# EAGLE design Power Stage (EAGLE 5.11)

## Sheet 1 of 7
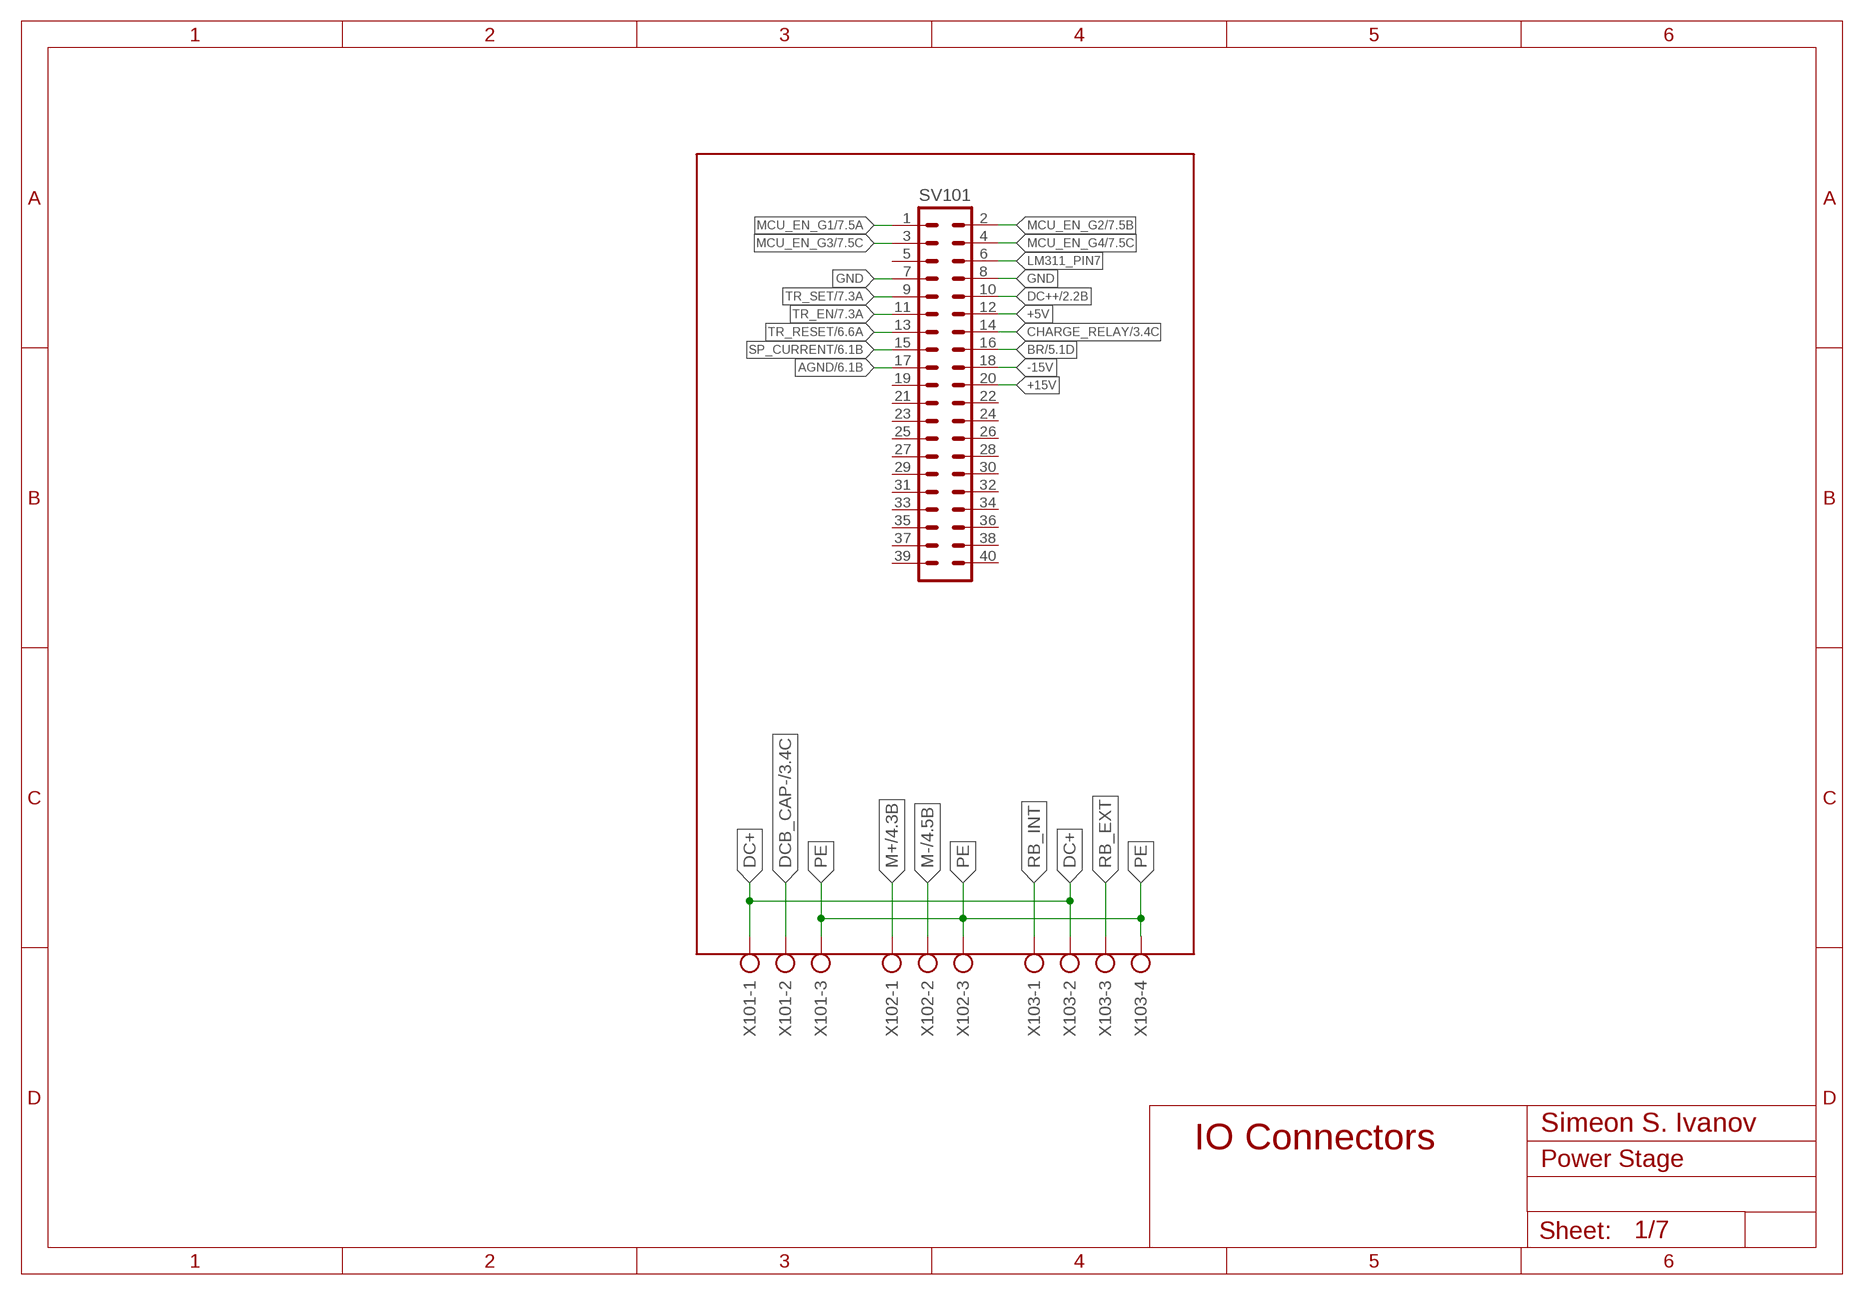
[diagram p0: schematic, sheet 1]

### Parts
SV101  ML40  [ML40]
X101  AK500/3-H  [AK500/3-H]
X102  AK500/3-H  [AK500/3-H]
X103  AK500/4-H  [AK500/4-H]

### Nets
+5V: SV101.12 ; also sheet 2,6,7
+15V: SV101.20 ; also sheet 2,6
-15V: SV101.18 ; also sheet 2,6
AGND: SV101.17 ; also sheet 2,4,6
BR: SV101.16 ; also sheet 5
CHARGE_RELAY: SV101.14 ; also sheet 3
DC+: X101.1 X103.2
DC++: SV101.10 ; also sheet 2,3
DCB_CAP-: X101.2 ; also sheet 3,4
GND: SV101.7 SV101.8 ; also sheet 2,4,5,6,7
LM311_PIN7: SV101.6
M+: X102.1 ; also sheet 4
M-: X102.2 ; also sheet 4
MCU_EN_G1: SV101.1 ; also sheet 7
MCU_EN_G2: SV101.2 ; also sheet 7
MCU_EN_G3: SV101.3 ; also sheet 7
MCU_EN_G4: SV101.4 ; also sheet 7
PE: X101.3 X102.3 X103.4
RB_EXT: X103.3 ; also sheet 3
RB_INT: X103.1 ; also sheet 3
SP_CURRENT: SV101.15 ; also sheet 6
TR_EN: SV101.11 ; also sheet 7
TR_RESET: SV101.13 ; also sheet 6,7
TR_SET: SV101.9 ; also sheet 7
Unconnected: SV101.5 SV101.19 SV101.21 SV101.22 SV101.23 SV101.24 SV101.25 SV101.26 SV101.27 SV101.28 SV101.29 SV101.30 SV101.31 SV101.32 SV101.33 SV101.34 SV101.35 SV101.36 SV101.37 SV101.38 SV101.39 SV101.40

### Notes on the sheet
- Simeon S. Ivanov
- IO Connectors

## Sheet 2 of 7
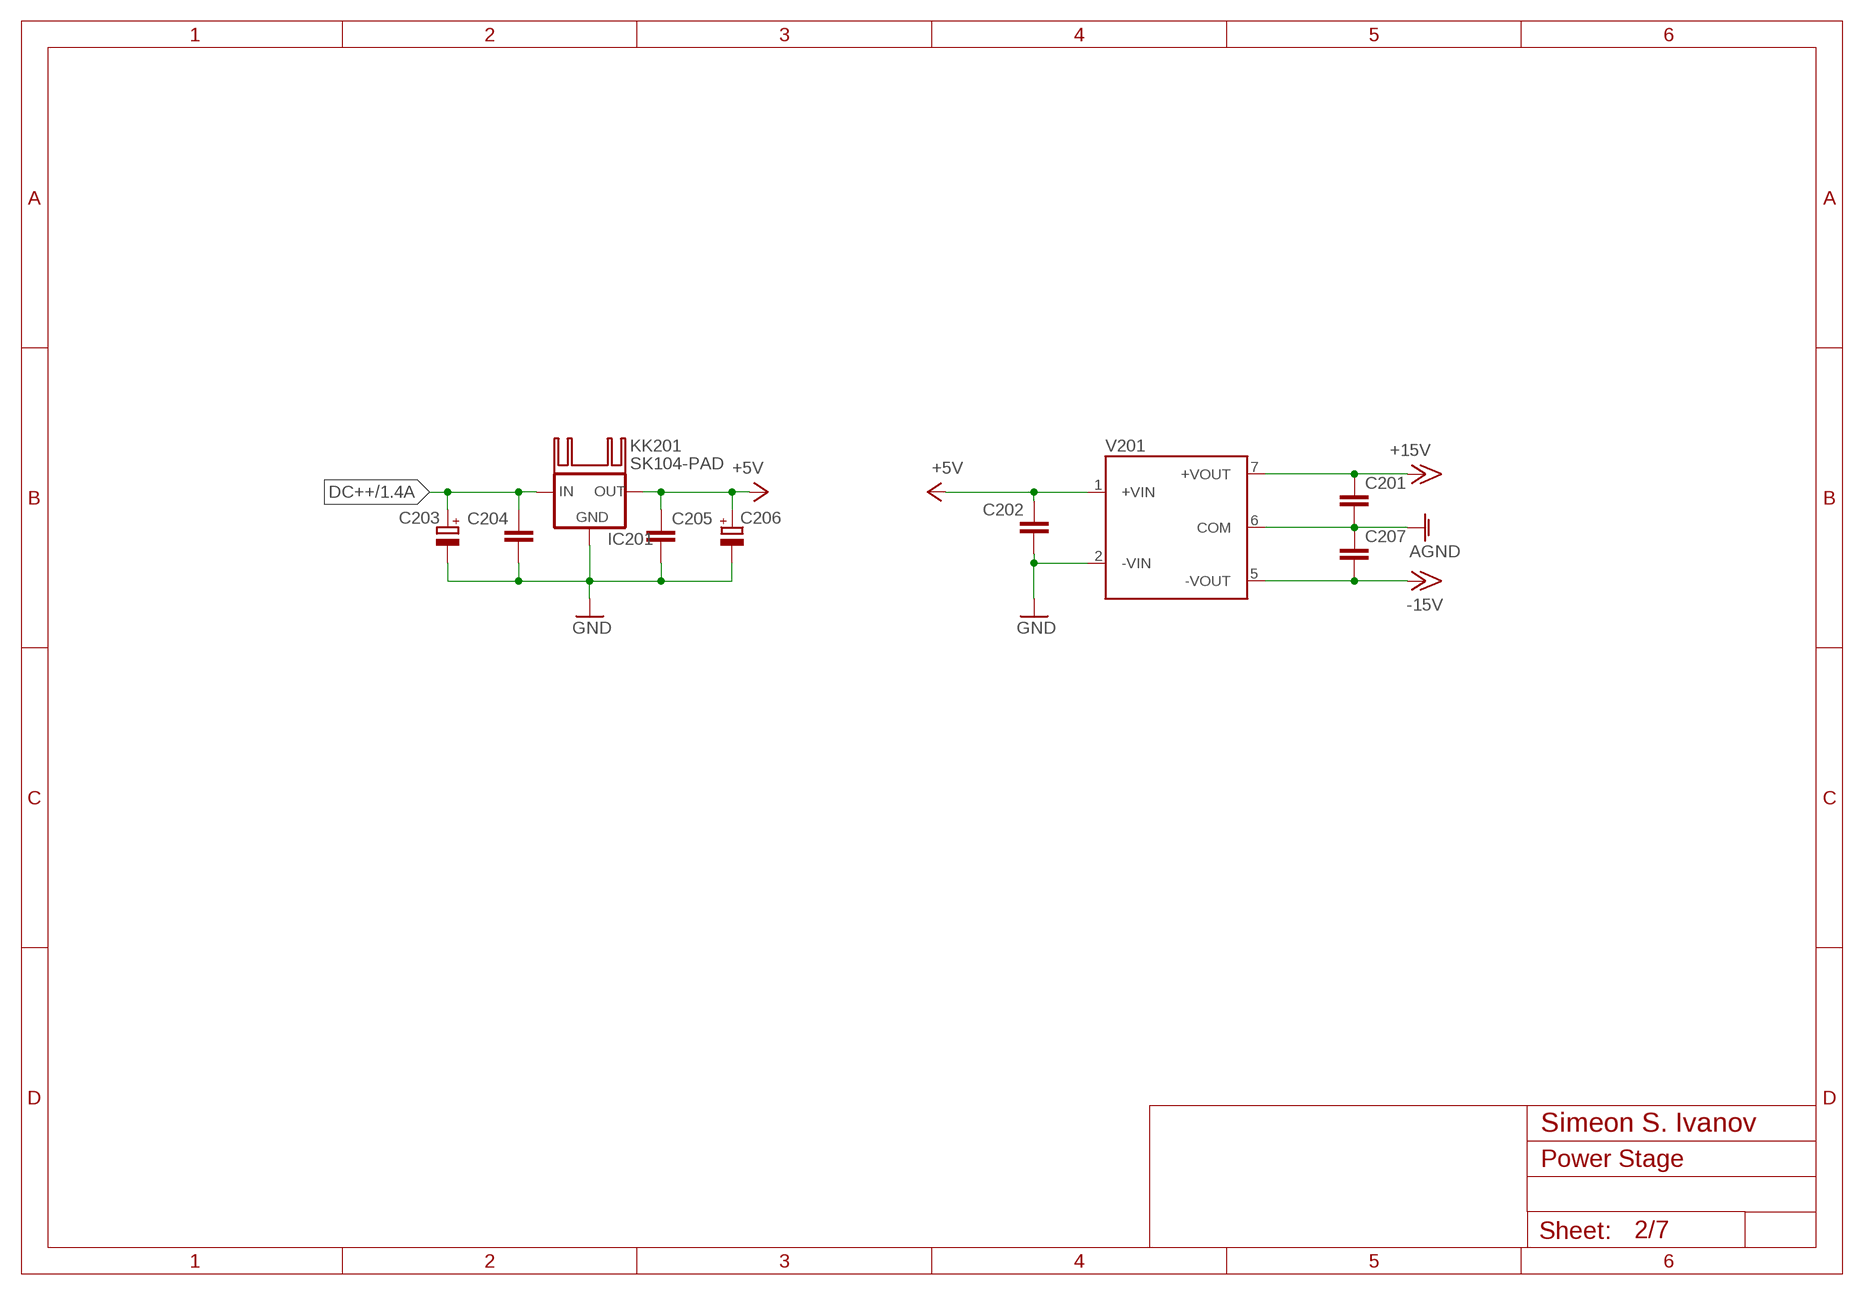
[diagram p1: schematic, sheet 2]

### Parts
C201  C-EU050-024X044  [C050-024X044]
C202  C-EU050-024X044  [C050-024X044]
C203  CPOL-EUE2.5-6  [E2,5-6]
C204  C-EU050-024X044  [C050-024X044]
C205  C-EU050-024X044  [C050-024X044]
C206  CPOL-EUE2.5-6  [E2,5-6]
C207  C-EU050-024X044  [C050-024X044]
IC201  78XXS  [78XXS]
KK201  SK104-PAD  [SK104-PAD]
V201  TMV0515D  [TMV_DUAL]

### Nets
+5V: C202.1 C205.1 C206.+ IC201.OUT V201.1(+VIN) ; also sheet 1,6,7
+15V: C201.1 V201.7(+VOUT) ; also sheet 1,6
-15V: C207.2 V201.5(-VOUT) ; also sheet 1,6
AGND: C201.2 C207.1 V201.6(COM) ; also sheet 1,4,6
DC++: C203.+ C204.1 IC201.IN ; also sheet 1,3
GND: C202.2 C203.- C204.2 C205.2 C206.- IC201.GND V201.2(-VIN) ; also sheet 1,4,5,6,7
Unconnected: KK201.K1(K) KK201.K2(K)

### Notes on the sheet
- Simeon S. Ivanov

## Sheet 3 of 7
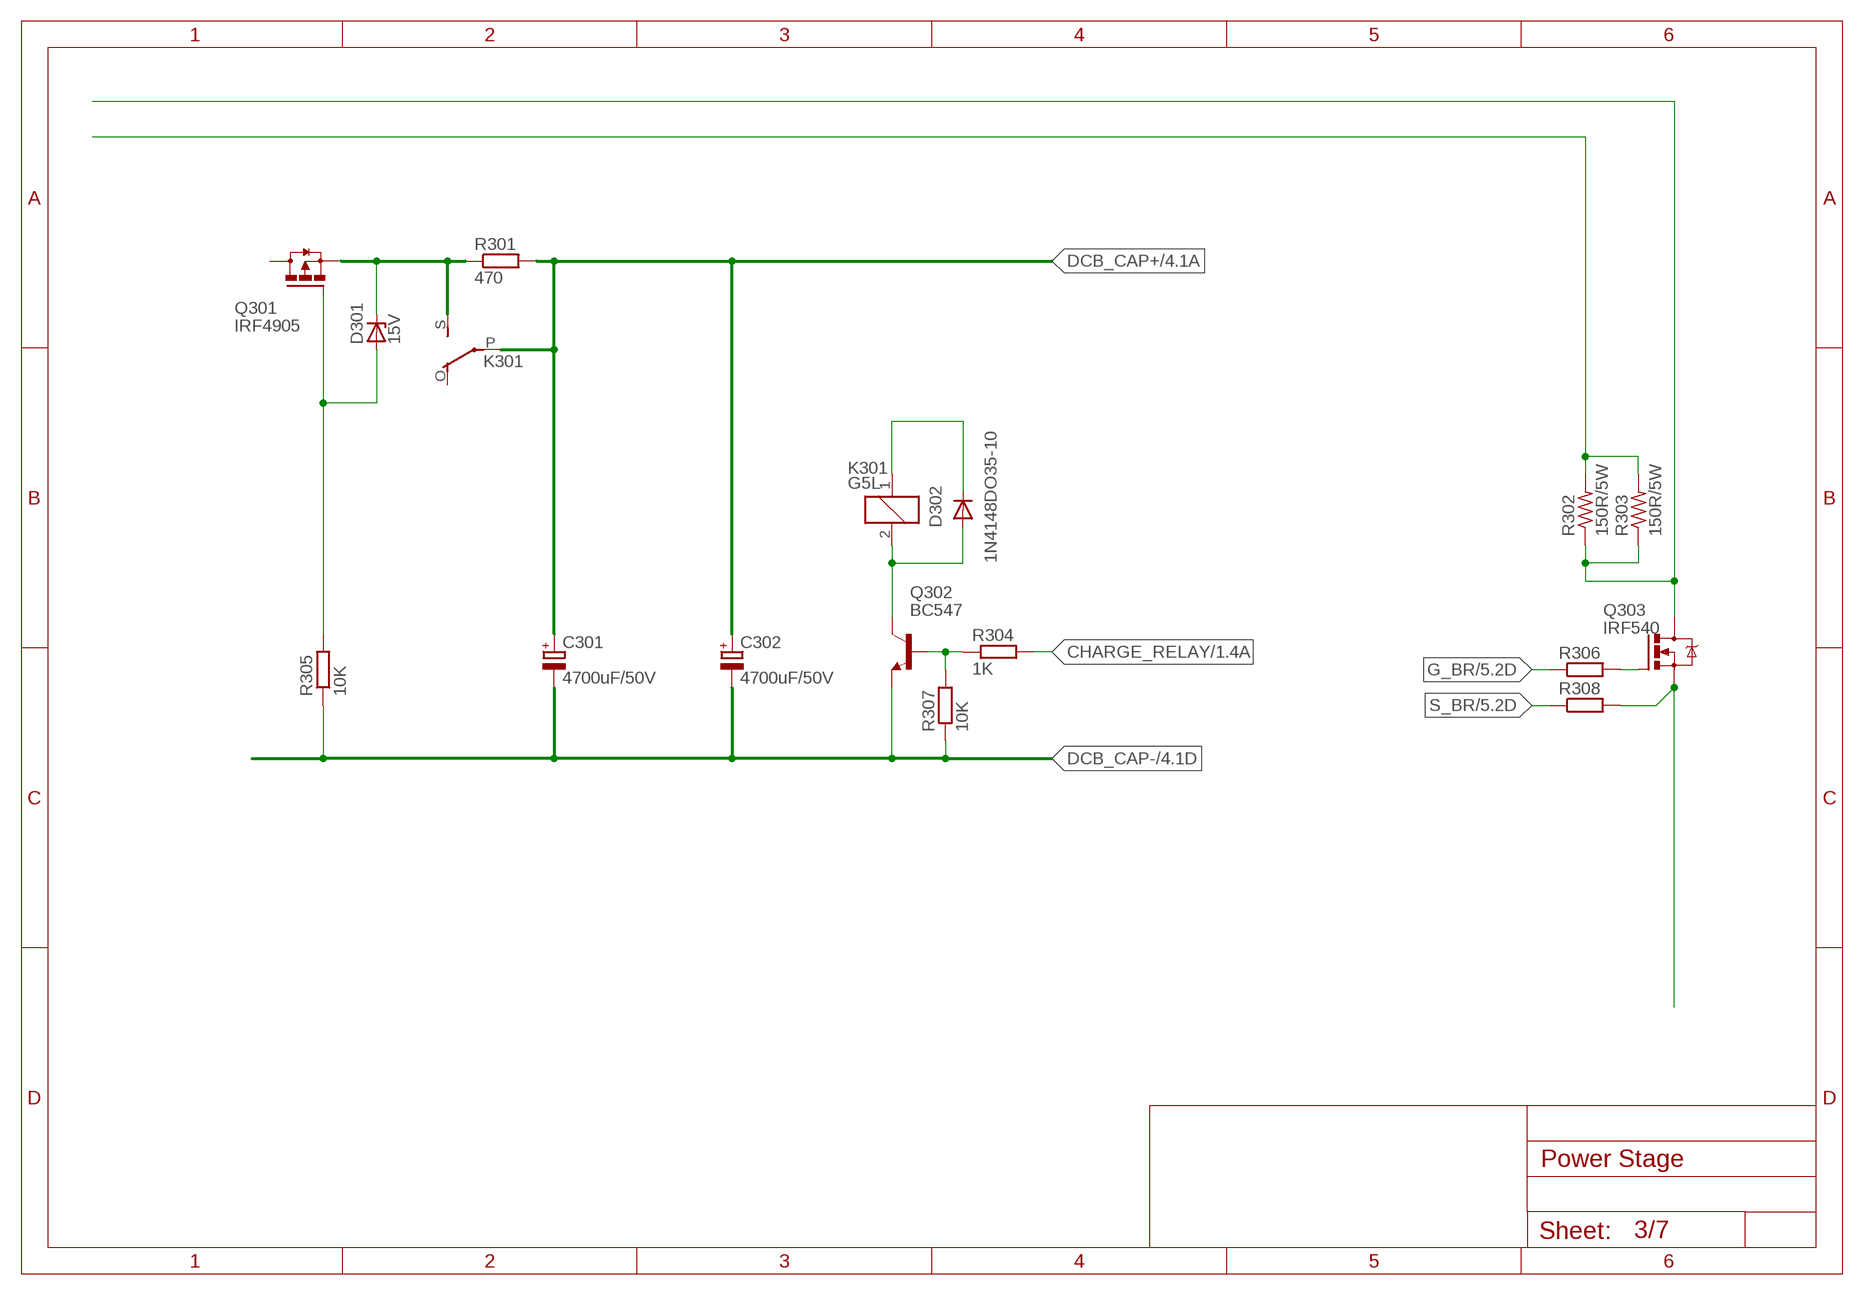
[diagram p2: schematic, sheet 3]

### Parts
C301  4700uF/50V  CPOL-EUE10-25  [EB25D]
C302  4700uF/50V  CPOL-EUE10-25  [EB25D]
D301  15V  ZENER-DIODEZD-5  [ZDIO-5]
D302  1N4148DO35-10  [DO35-10]
K301  G5L  [G5LE]
Q301  IRF4905  PMOSFET_PTO220V  [TO220V]
Q302  BC547  [TO92]
Q303  IRF540  [TO220BV]
R301  470  R-EU_0414/15  [0414/15]
R302  150R/5W  R-US_VTA54  [VTA54]
R303  150R/5W  R-US_VTA54  [VTA54]
R304  1K  R-EU_0207/10  [0207/10]
R305  10K  R-EU_0204/5  [0204/5]
R306  R-EU_0207/10  [0207/10]
R307  10K  R-EU_0204/2V  [0204V]
R308  R-EU_0207/10  [0207/10]

### Nets
CHARGE_RELAY: R304.1 ; also sheet 1
DC++: D301.C K301.S(2:S) Q301.3(S) R301.1 ; also sheet 1,2
DCB_CAP+: C301.+ C302.+ K301.P(2:P) R301.2 ; also sheet 4
DCB_CAP-: C301.- C302.- Q302.1(E) R305.1 R307.1 ; also sheet 1,4
G_BR: R306.1 ; also sheet 5
N$1: D302.C K301.1
N$15: Q303.G R306.2
N$19: Q303.S R308.2
N$42: D301.A Q301.1(G) R305.2
N$59: D302.A K301.2 Q302.3(C)
N$109: Q302.2(B) R304.2 R307.2
RB_EXT: Q303.D R302.1 R303.1 ; also sheet 1
RB_INT: R302.2 R303.2 ; also sheet 1
S_BR: R308.1 ; also sheet 5
Unconnected: K301.O(2:O) Q301.2(D)

## Sheet 4 of 7
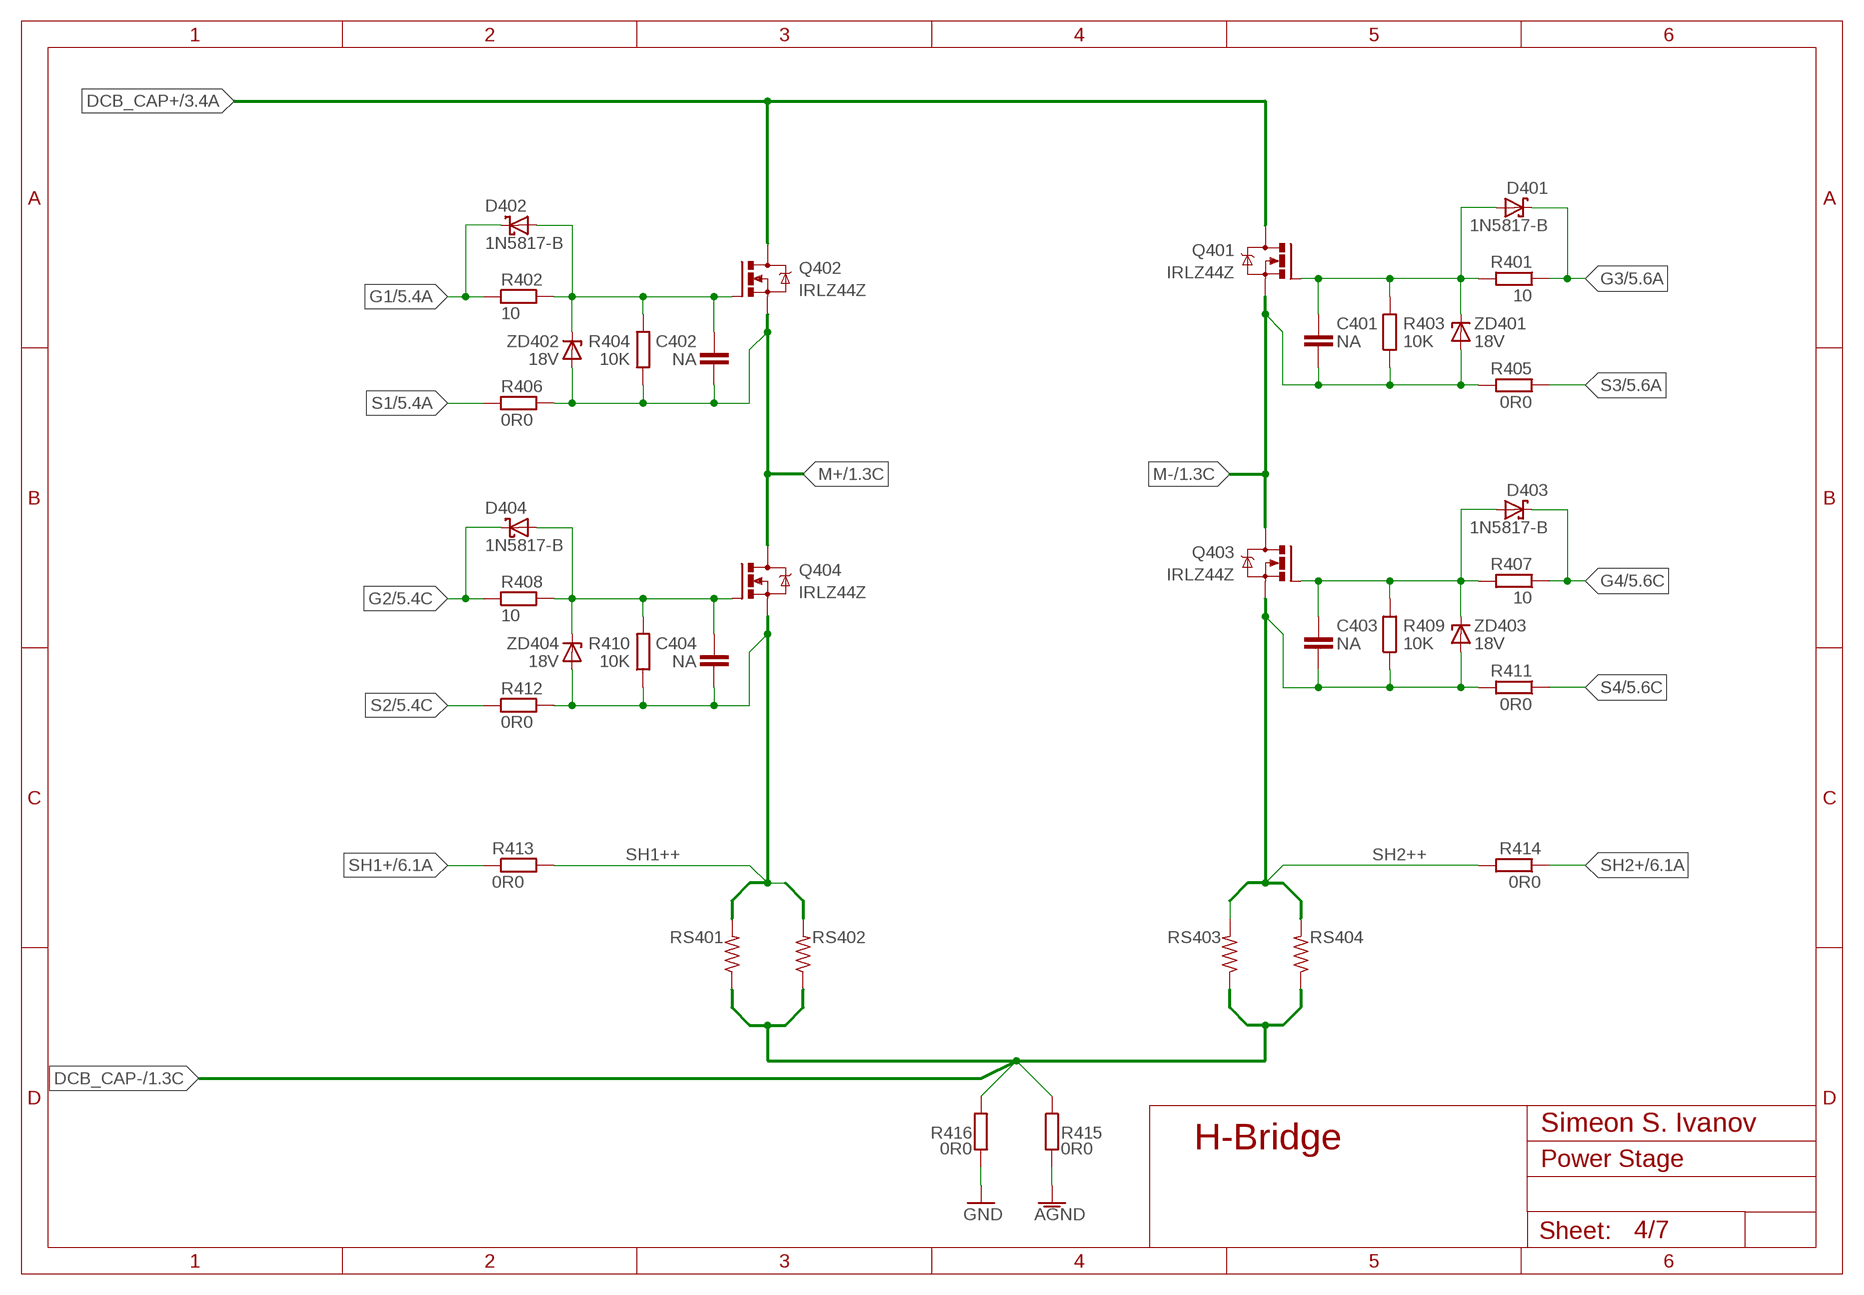
[diagram p3: schematic, sheet 4]

### Parts
C401  NA  C-EUC1206  [C1206]
C402  NA  C-EUC1206  [C1206]
C403  NA  C-EUC1206  [C1206]
C404  NA  C-EUC1206  [C1206]
D401  1N5817-B  [DO41-7.6]
D402  1N5817-B  [DO41-7.6]
D403  1N5817-B  [DO41-7.6]
D404  1N5817-B  [DO41-7.6]
Q401  IRLZ44Z  [TO220BH]
Q402  IRLZ44Z  [TO220BH]
Q403  IRLZ44Z  [TO220BH]
Q404  IRLZ44Z  [TO220BH]
R401  10  R-EU_R1206  [R1206]
R402  10  R-EU_R1206  [R1206]
R403  10K  R-EU_R1206  [R1206]
R404  10K  R-EU_R1206  [R1206]
R405  0R0  R-EU_R1206  [R1206]
R406  0R0  R-EU_R1206  [R1206]
R407  10  R-EU_R1206  [R1206]
R408  10  R-EU_R1206  [R1206]
R409  10K  R-EU_R1206  [R1206]
R410  10K  R-EU_R1206  [R1206]
R411  0R0  R-EU_R1206  [R1206]
R412  0R0  R-EU_R1206  [R1206]
R413  0R0  R-EU_0207/10  [0207/10]
R414  0R0  R-EU_0207/10  [0207/10]
R415  0R0  R-EU_0207/10  [0207/10]
R416  0R0  R-EU_0204/7  [0204/7]
RS401  R-US_R2010  [R2010]
RS402  R-US_R2010  [R2010]
RS403  R-US_R2010  [R2010]
RS404  R-US_R2010  [R2010]
ZD401  18V  ZENER-DIODESOD80C  [SOD80C]
ZD402  18V  ZENER-DIODESOD80C  [SOD80C]
ZD403  18V  ZENER-DIODESOD80C  [SOD80C]
ZD404  18V  ZENER-DIODESOD80C  [SOD80C]

### Nets
AGND: R415.2 ; also sheet 1,2,6
DCB_CAP+: Q401.D Q402.D ; also sheet 3
DCB_CAP-: R415.1 R416.2 RS401.1 RS402.1 RS403.1 RS404.1 ; also sheet 1,3
G1: D402.C R402.1 ; also sheet 5
G2: D404.C R408.1 ; also sheet 5
G3: D401.C R401.1 ; also sheet 5
G4: D403.C R407.1 ; also sheet 5
GND: R416.1 ; also sheet 1,2,5,6,7
M+: C402.2 Q402.S Q404.D R404.1 R406.2 ZD402.A ; also sheet 1
M-: C401.2 Q401.S Q403.D R403.1 R405.2 ZD401.A ; also sheet 1
Q3_G: C404.1 D404.A Q404.G R408.2 R410.2 ZD404.C
Q3_G1: C402.1 D402.A Q402.G R402.2 R404.2 ZD402.C
Q3_G2: C401.1 D401.A Q401.G R401.2 R403.2 ZD401.C
Q3_G3: C403.1 D403.A Q403.G R407.2 R409.2 ZD403.C
S1: R406.1 ; also sheet 5
S2: R412.1 ; also sheet 5
S3: R405.1 ; also sheet 5
S4: R411.1 ; also sheet 5
SH1+: R413.1 ; also sheet 6
SH1++: C404.2 Q404.S R410.1 R412.2 R413.2 RS401.2 RS402.2 ZD404.A
SH2+: R414.1 ; also sheet 6
SH2++: C403.2 Q403.S R409.1 R411.2 R414.2 RS403.2 RS404.2 ZD403.A

### Notes on the sheet
- Simeon S. Ivanov
- H-Bridge

## Sheet 5 of 7
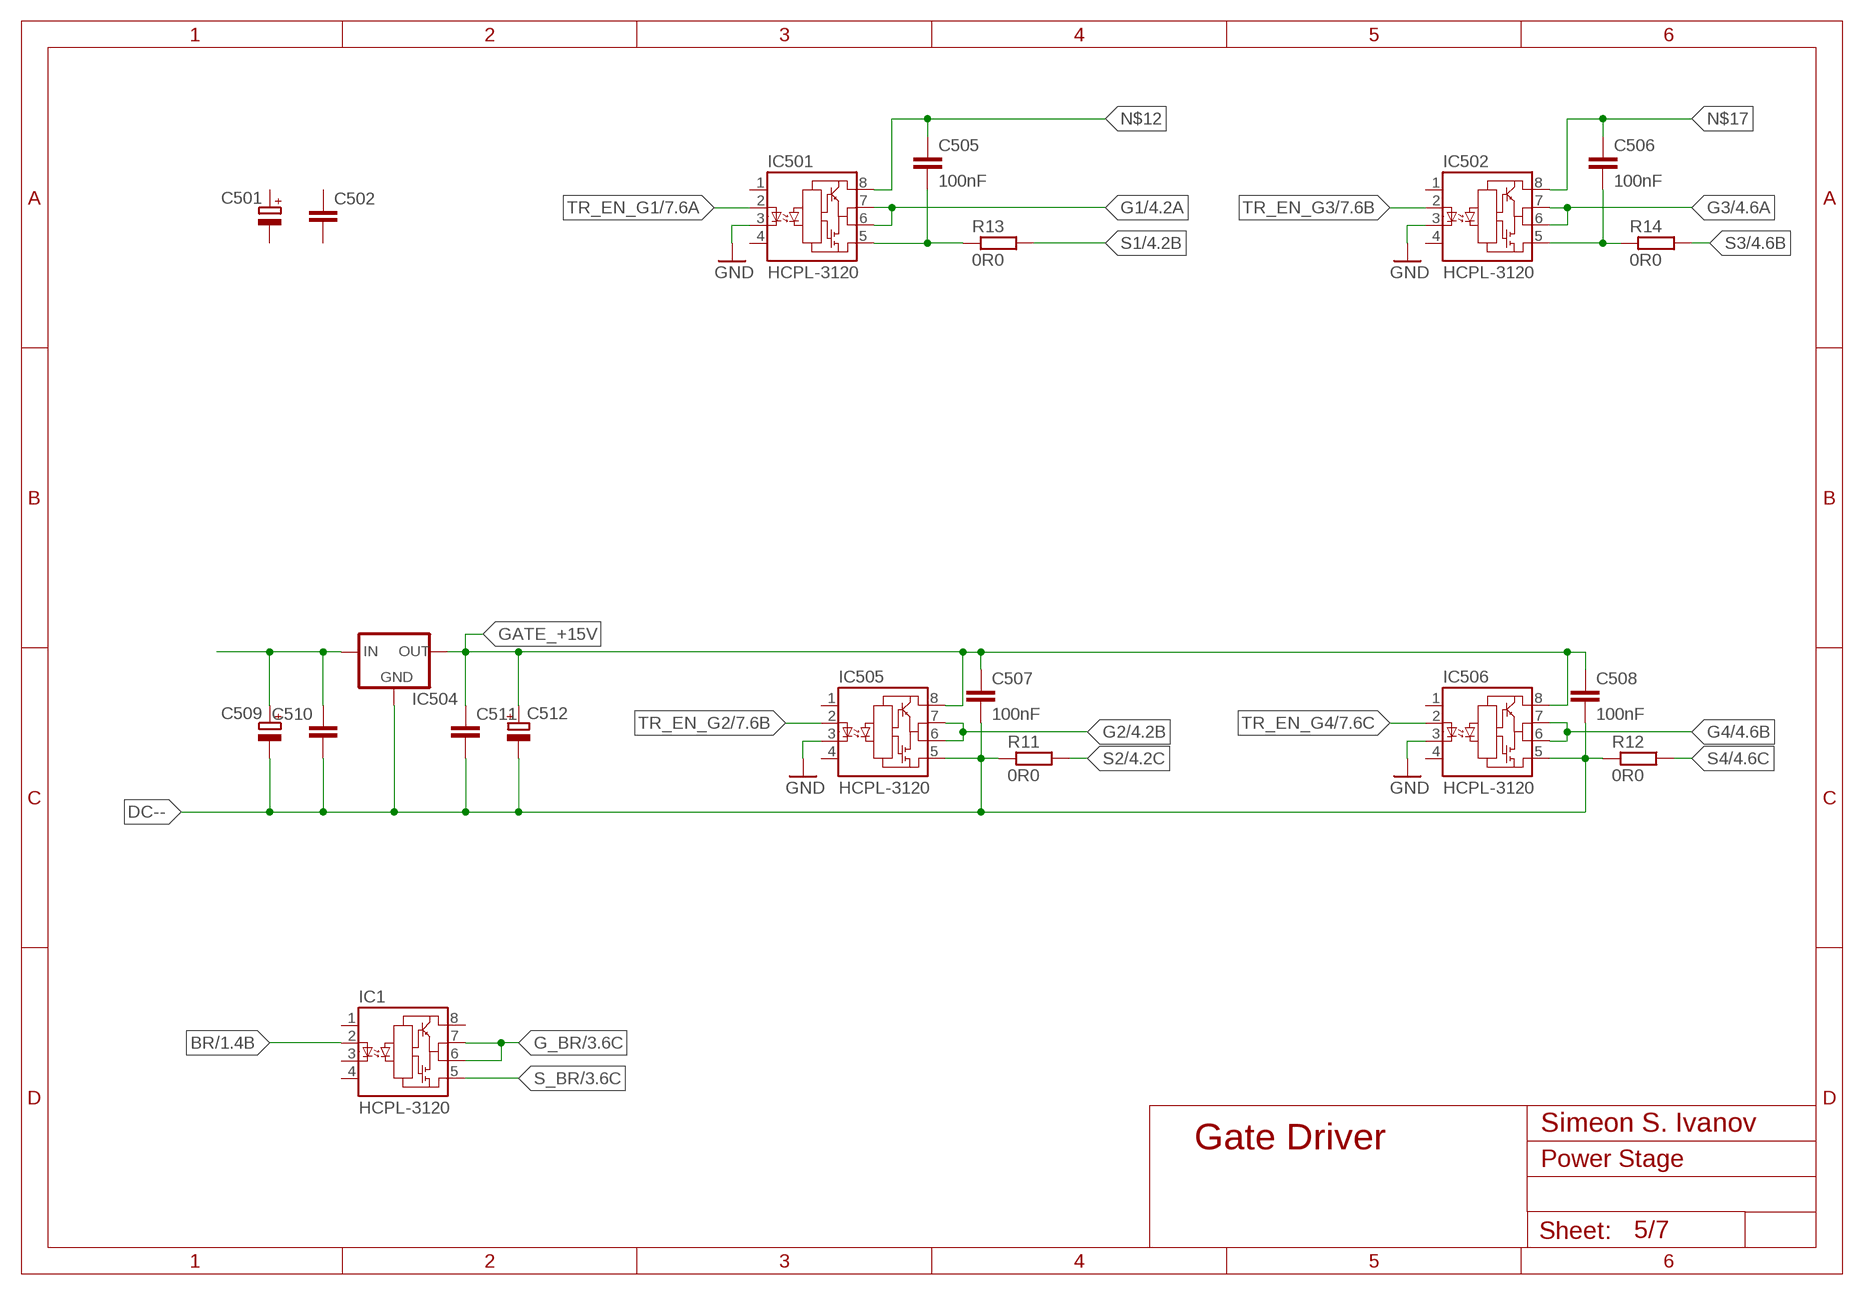
[diagram p4: schematic, sheet 5]

### Parts
C501  CPOL-EUE2.5-6  [E2,5-6]
C502  C-EU050-024X044  [C050-024X044]
C505  100nF  C-EU050-024X044  [C050-024X044]
C506  100nF  C-EU050-024X044  [C050-024X044]
C507  100nF  C-EUC1206  [C1206]
C508  100nF  C-EU050-024X044  [C050-024X044]
C509  CPOL-EUE2.5-6  [E2,5-6]
C510  C-EU050-024X044  [C050-024X044]
C511  C-EU050-024X044  [C050-024X044]
C512  CPOL-EUE2.5-6  [E2,5-6]
IC1  HCPL-3120  ELDI  [DIL8-SMD]
IC501  HCPL-3120  ELDI  [DIL8-SMD]
IC502  HCPL-3120  ELDI  [DIL8-SMD]
IC504  78XXS  [78XXS]
IC505  HCPL-3120  ELDI  [DIL8-SMD]
IC506  HCPL-3120  ELDI  [DIL8-SMD]
R11  0R0  R-EU_0204/2V  [0204V]
R12  0R0  R-EU_0204/2V  [0204V]
R13  0R0  R-EU_0204/2V  [0204V]
R14  0R0  R-EU_0204/2V  [0204V]

### Nets
BR: IC1.2 ; also sheet 1
DC--: C507.2 C508.2 C509.- C510.2 C511.2 C512.- IC504.GND IC505.5 IC506.5 R11.2 R12.2
G1: IC501.6 IC501.7 ; also sheet 4
G2: IC505.6 IC505.7 ; also sheet 4
G3: IC502.6 IC502.7 ; also sheet 4
G4: IC506.6 IC506.7 ; also sheet 4
G_BR: IC1.6 IC1.7 ; also sheet 3
GATE_+15V: C507.1 C508.1 C511.1 C512.+ IC504.OUT IC505.8 IC506.8
GND: IC501.3 IC502.3 IC505.3 IC506.3 ; also sheet 1,2,4,6,7
N$12: C505.1 IC501.8
N$17: C506.1 IC502.8
N$18: C509.+ C510.1 IC504.IN
N$22: C505.2 IC501.5 R13.2
N$23: C506.2 IC502.5 R14.2
S1: R13.1 ; also sheet 4
S2: R11.1 ; also sheet 4
S3: R14.1 ; also sheet 4
S4: R12.1 ; also sheet 4
S_BR: IC1.5 ; also sheet 3
TR_EN_G1: IC501.2 ; also sheet 7
TR_EN_G2: IC505.2 ; also sheet 7
TR_EN_G3: IC502.2 ; also sheet 7
TR_EN_G4: IC506.2 ; also sheet 7
Unconnected: C501.+ C501.- C502.1 C502.2 IC1.1 IC1.3 IC1.4 IC1.8 IC501.1 IC501.4 IC502.1 IC502.4 IC505.1 IC505.4 IC506.1 IC506.4

### Notes on the sheet
- Simeon S. Ivanov
- Gate Driver

## Sheet 6 of 7
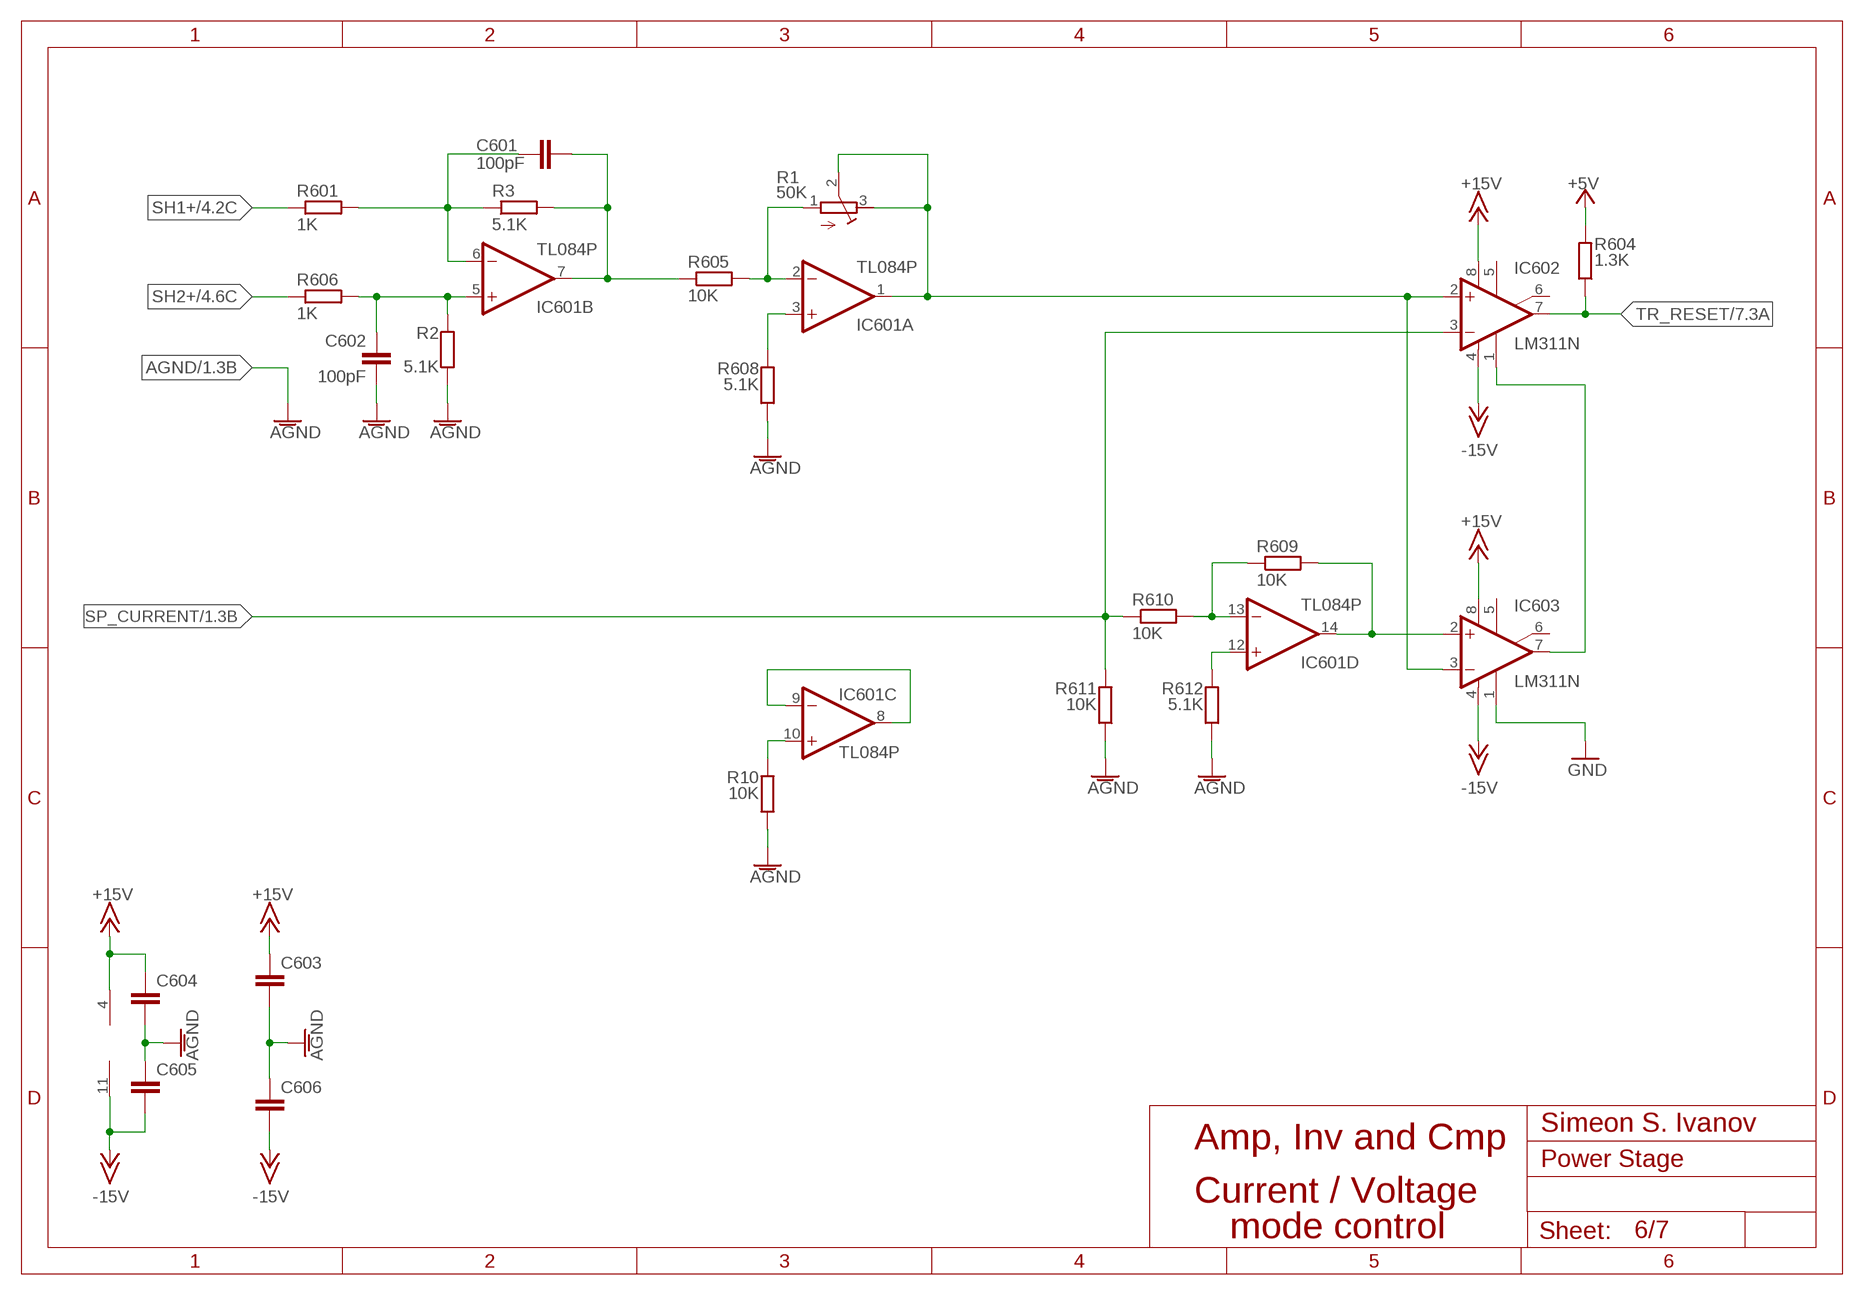
[diagram p5: schematic, sheet 6]

### Parts
C601  100pF  C-EU050-024X044  [C050-024X044]
C602  100pF  C-EU050-024X044  [C050-024X044]
C603  C-EUC0805  [C0805]
C604  C-EUC0805  [C0805]
C605  C-EUC0805  [C0805]
C606  C-EUC0805  [C0805]
IC601  TL084P  [DIL14]
IC602  LM311N  [DIL08]
IC603  LM311N  [DIL08]
R1  50K  R-TRIMM3296W  [RTRIM3296W]
R2  5.1K  R-EU_0204/2V  [0204V]
R3  5.1K  R-EU_0204/2V  [0204V]
R10  10K  R-EU_0204/2V  [0204V]
R601  1K  R-EU_0204/2V  [0204V]
R604  1.3K  R-EU_0204/2V  [0204V]
R605  10K  R-EU_0204/2V  [0204V]
R606  1K  R-EU_0204/2V  [0204V]
R608  5.1K  R-EU_0204/2V  [0204V]
R609  10K  R-EU_0204/2V  [0204V]
R610  10K  R-EU_0204/2V  [0204V]
R611  10K  R-EU_0204/2V  [0204V]
R612  5.1K  R-EU_0204/2V  [0204V]

### Nets
+5V: R604.2 ; also sheet 1,2,7
+15V: C603.1 C604.1 IC601.4(P:V+) IC602.8(V+) IC603.8(V+) ; also sheet 1,2
-15V: C605.2 C606.2 IC601.11(P:V-) IC602.4(V-) IC603.4(V-) ; also sheet 1,2
AGND: C602.1 C603.2 C604.2 C605.1 C606.1 R2.2 R10.1 R608.2 R611.1 R612.2 ; also sheet 1,2,4
ANALOG_IN_AC: IC601.1(A:OUT) IC602.2(+IN) IC603.3(-IN) R1.2(S) R1.3(A)
GND: IC603.1(GND) ; also sheet 1,2,4,5,7
N$6: C601.1 IC601.6(B:-IN) R3.1 R601.2
N$9: IC601.8(C:OUT) IC601.9(C:-IN)
N$10: C602.2 IC601.5(B:+IN) R2.1 R606.2
N$14: IC601.10(C:+IN) R10.2
N$37: IC601.3(A:+IN) R608.1
N$38: IC601.2(A:-IN) R1.1(E) R605.2
N$100: C601.2 IC601.7(B:OUT) R3.2 R605.1
N$101: IC602.1(GND) IC603.7(OUT)
N$102: IC601.14(D:OUT) IC603.2(+IN) R609.2
N$103: IC601.13(D:-IN) R609.1 R610.2
N$104: IC601.12(D:+IN) R612.1
SH1+: R601.1 ; also sheet 4
SH2+: R606.1 ; also sheet 4
SP_CURRENT: IC602.3(-IN) R610.1 R611.2 ; also sheet 1
TR_RESET: IC602.7(OUT) R604.1 ; also sheet 1,7
Unconnected: IC602.5(ON) IC602.6(ON/STR) IC603.5(ON) IC603.6(ON/STR)

### Notes on the sheet
- Simeon S. Ivanov
- Amp, Inv and Cmp
- Current / Voltage
- mode control

## Sheet 7 of 7
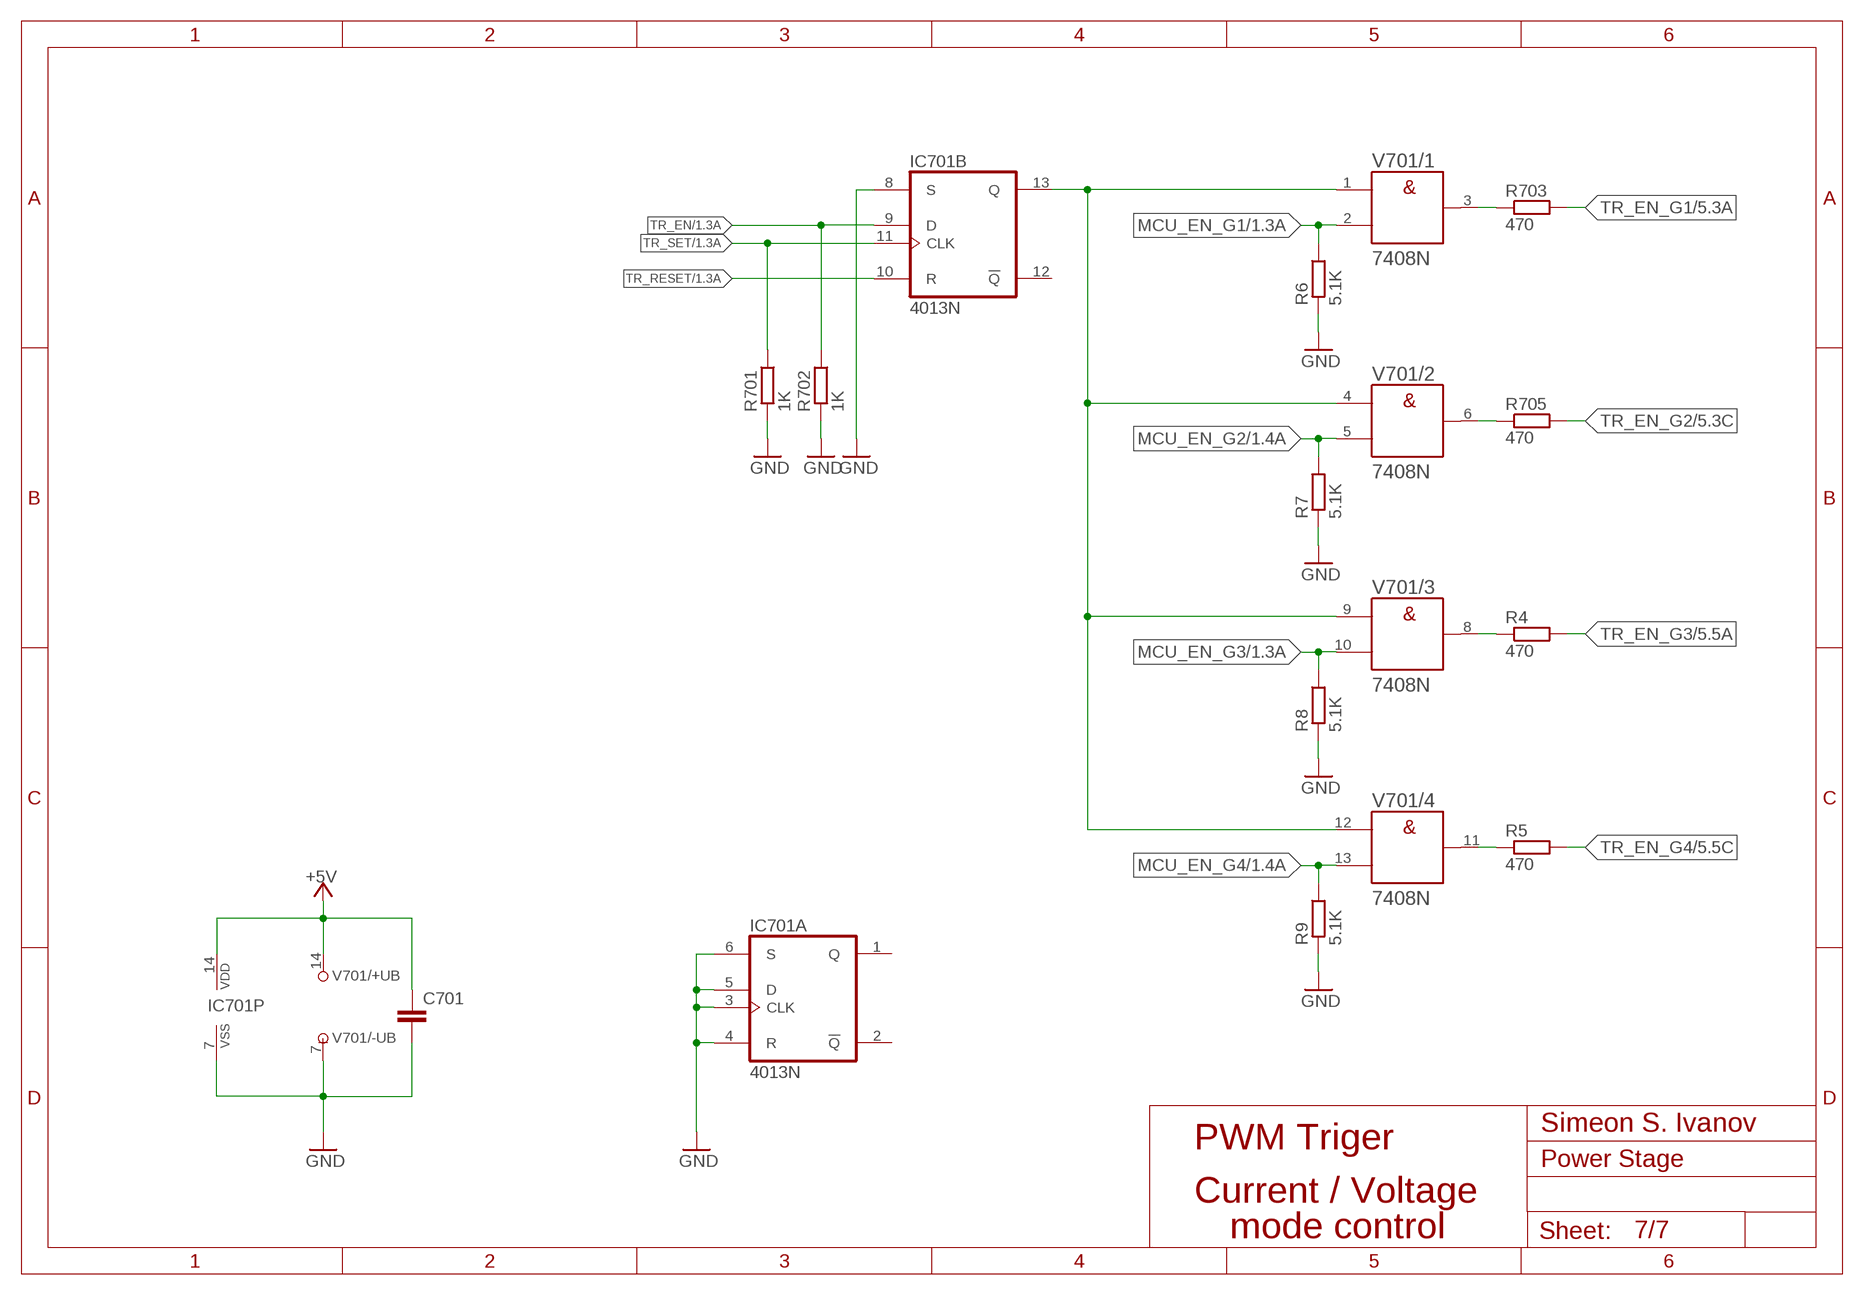
[diagram p6: schematic, sheet 7]

### Parts
C701  C-EU050-024X044  [C050-024X044]
IC701  4013N  [DIL14]
R4  470  R-EU_0204/2V  [0204V]
R5  470  R-EU_0204/2V  [0204V]
R6  5.1K  R-EU_0204/2V  [0204V]
R7  5.1K  R-EU_0204/2V  [0204V]
R8  5.1K  R-EU_0204/2V  [0204V]
R9  5.1K  R-EU_0204/2V  [0204V]
R701  1K  R-EU_0204/2V  [0204V]
R702  1K  R-EU_0204/2V  [0204V]
R703  470  R-EU_0204/2V  [0204V]
R705  470  R-EU_0204/2V  [0204V]
V701  7408N  [DIL14]

### Nets
+5V: C701.1 IC701.14(P:VDD) V701.14(/+UB:+UB) ; also sheet 1,2,6
GND: C701.2 IC701.3(A:CLK) IC701.4(A:R) IC701.5(A:D) IC701.6(A:S) IC701.7(P:VSS) IC701.8(B:S) R6.2 R7.2 R8.2 R9.2 R701.2 R702.2 V701.7(/-UB:-UB) ; also sheet 1,2,4,5,6
MCU_EN_G1: R6.1 V701.2(/1:B) ; also sheet 1
MCU_EN_G2: R7.1 V701.5(/2:B) ; also sheet 1
MCU_EN_G3: R8.1 V701.10(/3:B) ; also sheet 1
MCU_EN_G4: R9.1 V701.13(/4:B) ; also sheet 1
N$7: R5.1 V701.11(/4:Y)
N$8: R4.1 V701.8(/3:Y)
N$107: R705.1 V701.6(/2:Y)
N$108: R703.1 V701.3(/1:Y)
TR_EN: IC701.9(B:D) R702.1 ; also sheet 1
TR_EN_G1: R703.2 ; also sheet 5
TR_EN_G2: R705.2 ; also sheet 5
TR_EN_G3: R4.2 ; also sheet 5
TR_EN_G4: R5.2 ; also sheet 5
TR_EN_GATE: IC701.13(B:Q) V701.1(/1:A) V701.4(/2:A) V701.9(/3:A) V701.12(/4:A)
TR_RESET: IC701.10(B:R) ; also sheet 1,6
TR_SET: IC701.11(B:CLK) R701.1 ; also sheet 1
Unconnected: IC701.1(A:Q) IC701.2(A:!Q) IC701.12(B:!Q)

### Notes on the sheet
- Simeon S. Ivanov
- PWM Triger
- Current / Voltage
- mode control

## Library data of the parts
C201 C202 C204 C205 C207 C401-C404 C502 C505-C508 C510 C511 C601-C606 C701 = rcl:C-EU: CAPACITOR, European symbol
C203 C206 C301 C302 C501 C509 C512 = rcl:CPOL-EU: POLARIZED CAPACITOR, European symbol
D301 ZD401-ZD404 = diode:ZENER-DIODE: Z-Diode
D302 = diode:1N4148: DIODE high speed (Philips)
D401-D404 = diode:1N581*: 1.0A SCHOTTKY BARRIER RECTIFIER Source: http://www.diodes.com/datasheets/ds23001.pdf
IC1 IC501 IC502 IC505 IC506 = myOptocoupler:ELDI
IC201 IC504 = v-reg:78XXS: VOLTAGE REGULATOR
IC601 = linear:TL084: OP AMP
IC602 IC603 = linear:LM311: COMPARATOR
IC701 = 40xx:4013: Dual D FLIP FLOP, set/reset
K301 = relay:G5L: RELAY 1 x switch, 10 A/120 V AC, 8 A/30 V ADC, Omron; OC_FARNELL: unknown; OC_NEWARK: unknown
KK201 = heatsink:SK104-PAD: HEATSINK manufacturer Fischer/distributor Buerklin
Q301 = myTransistor-Power:PMOSFET_P
Q302 = transistor-npn:BC547*: NPN Transistor
Q303 = transistor-power:IRF540: HEXFET Power MOSFET
Q401-Q404 = transistor-power:IRLZ44Z: N-Channel HEXFET® Power MOSFET Logic Level AUTOMOTIVE MOSFET Source: http://www.irf.com/product-info/datasheets/data/irlz44zpbf.pdf
R1 = rcl:R-TRIMM: Trimm resistor
R2-R14 R301 R304-R308 R401-R416 R601 R604-R606 R608-R612 R701-R703 R705 = rcl:R-EU_: RESISTOR, European symbol
R302 R303 RS401-RS404 = rcl:R-US_: RESISTOR, American symbol
SV101 = con-harting-ml:ML40: HARTING; OC_FARNELL: unknown; OC_NEWARK: unknown
V201 = myTraco-electronic:TMV*?
V701 = 74ttl-din:74*08: Quad 2-input AND gate
X101 X102 = con-ptr500:AK500/3-H: CONNECTOR Aug. 2004 / PTR Meßtechnik: Die Bezeichnung der Serie AK505 wurde geändert. Es handelt sich hierbei um AK500 in horizontaler Ausführung.; OC_FARNELL: unknown; OC_NEWARK: unknown
X103 = con-ptr500:AK500/4-H: CONNECTOR Aug. 2004 / PTR Meßtechnik: Die Bezeichnung der Serie AK505 wurde geändert. Es handelt sich hierbei um AK500 in horizontaler Ausführung.; OC_FARNELL: unknown; OC_NEWARK: unknown

## Board
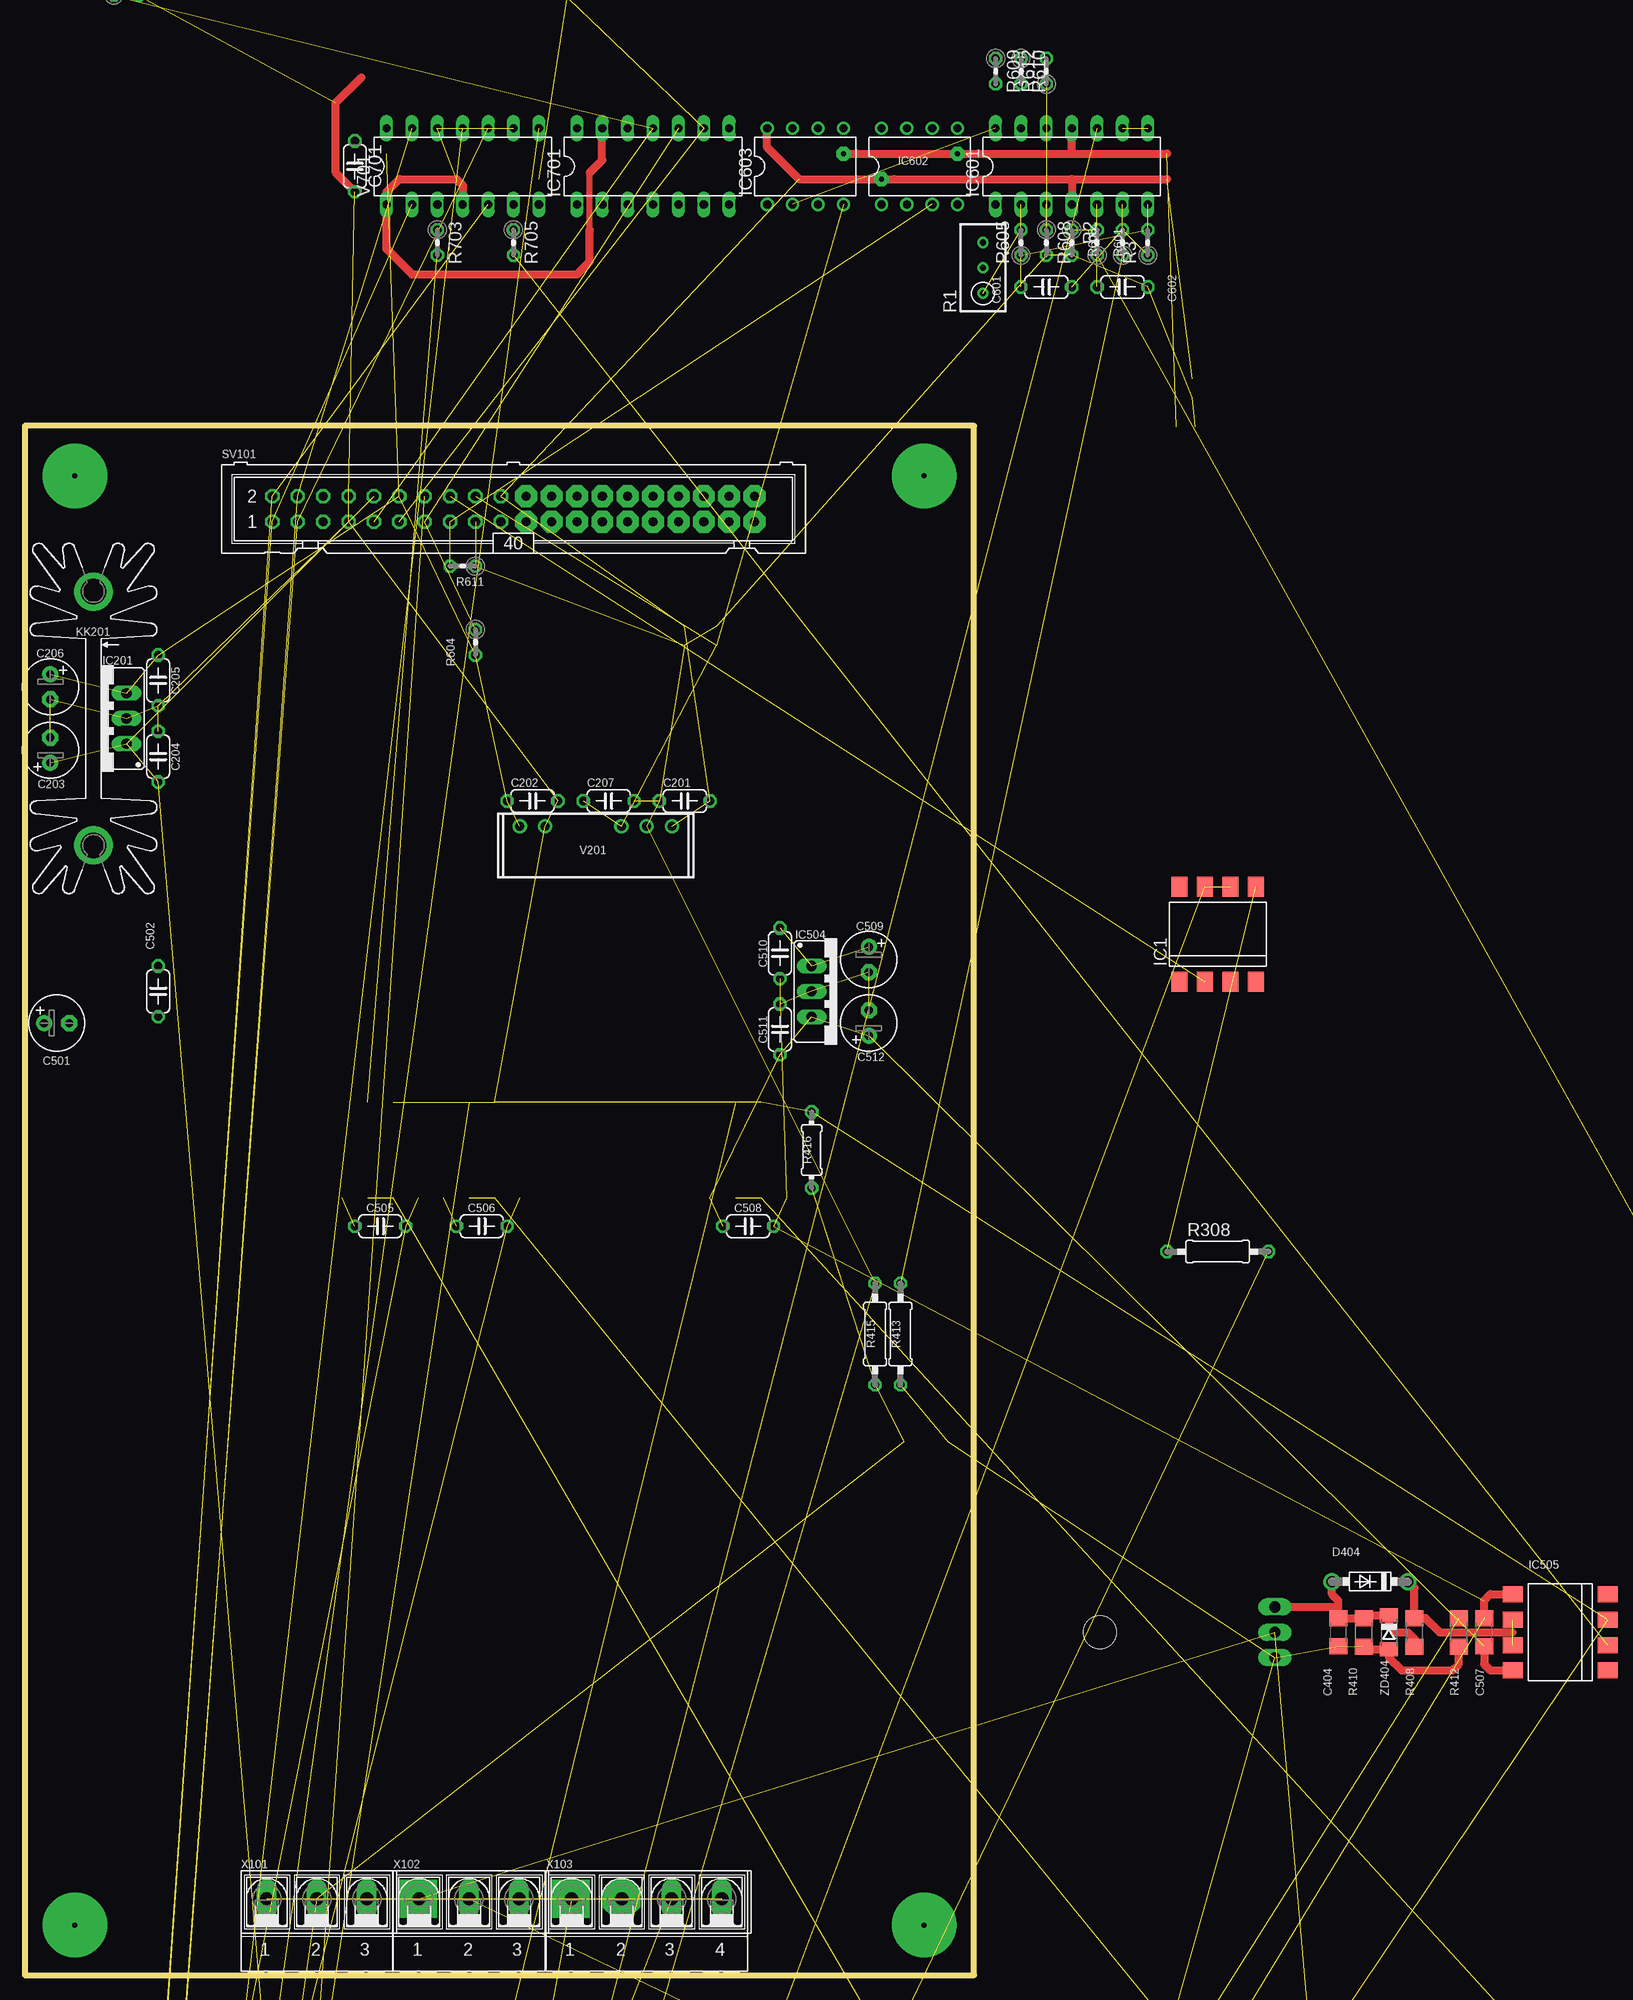
[diagram p7: board, top side]
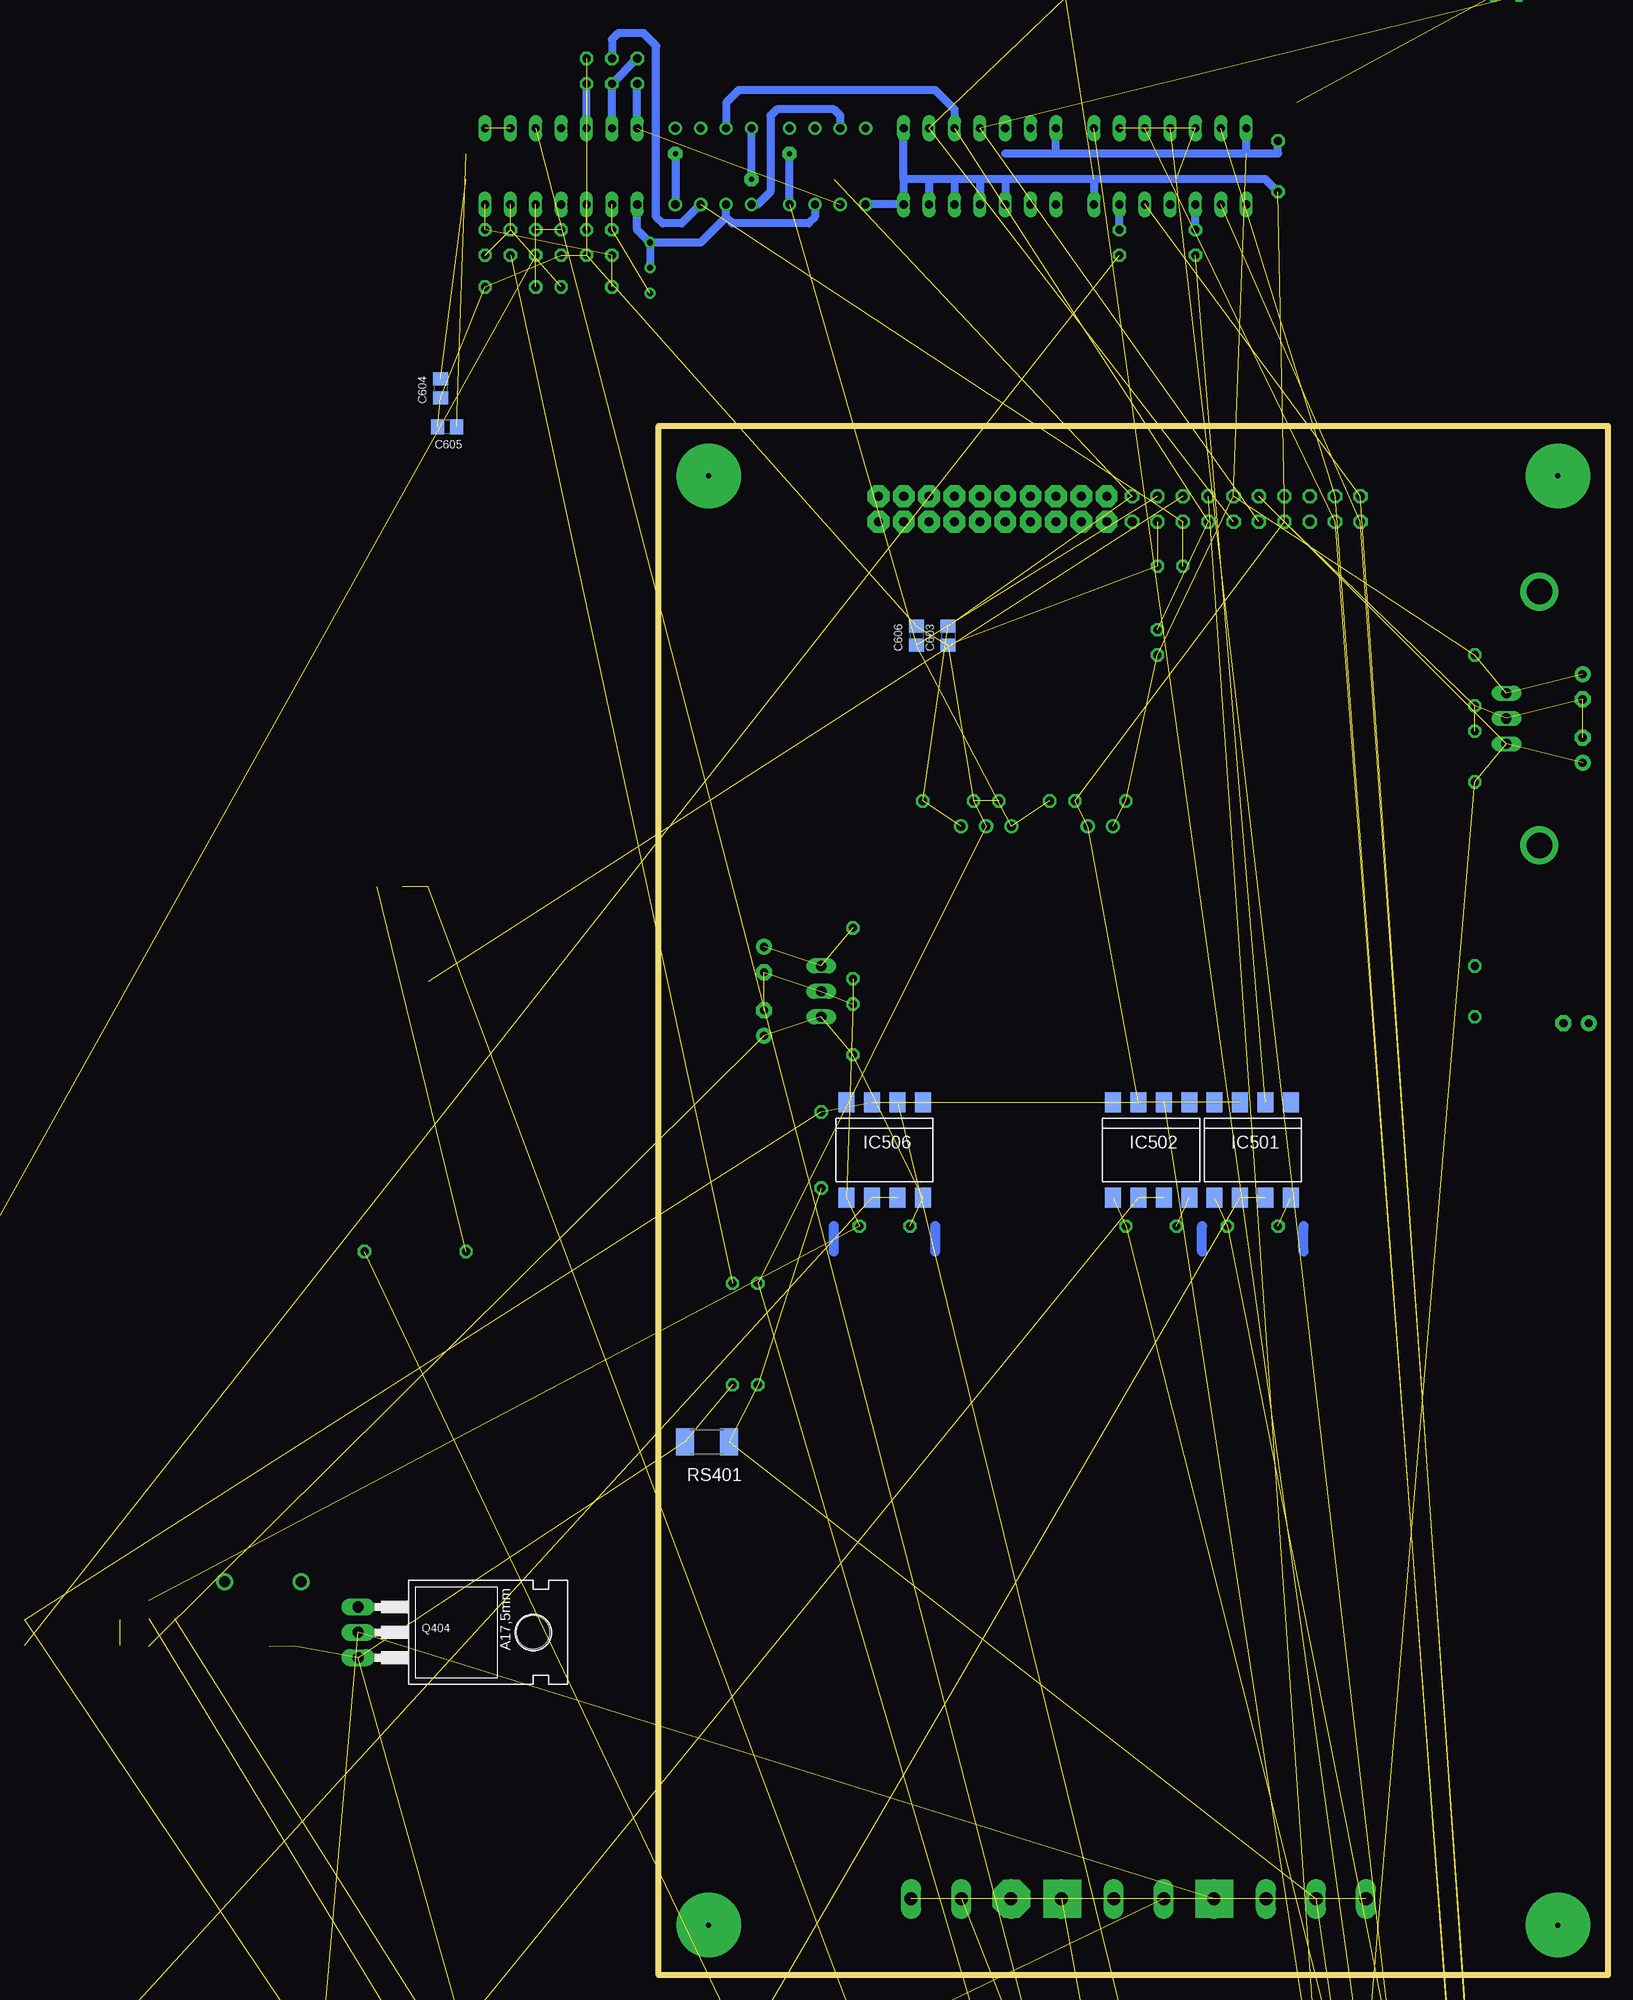
[diagram p8: board, bottom side, seen from below]

Size 95 x 155 mm. Coordinates in mm from the lower left corner, seen from the top.
Outline: 0,0 95,0 95,155 0,155 0,0
Copper layers (1*16): Top 0.035mm / dielectric 1.5mm / Bottom 0.035mm
Design rules "default": minimum track width 10mil, minimum drill 24mil, track to track 8mil, track to pad 8mil, pad to pad 8mil, via to via 8mil, smd to smd 8mil, copper to edge 40mil, drill to drill 8mil, minimum pad ring 10mil, minimum via ring 8mil, stop-mask expansion 4mil, vias tented up to drill 0mil, thermal gap 10mil

### Footprints (pad centres in the part's own frame; a part is rotated, then mirrored left to right if it is on the bottom)
C050-024X044 = drill 0.813 octagon: 1 -2.54,0; 2 2.54,0
E2,5-6 = drill 0.813 pad 1.6 round: + -1.27,0 | drill 0.813 pad 1.6 octagon: - 1.27,0
EB25D = drill 2.007 pad 4.597 round: + -5.08,0 | drill 2.007 pad 4.597 octagon: - 5.08,0
C1206 = smd 1.6 x 1.8: 1 -1.4,0; 2 1.4,0
C0805 = smd 1.3 x 1.5: 1 -0.95,0; 2 0.95,0
ZDIO-5 = drill 0.813 octagon: A 2.54,0; C -2.54,0
DO35-10 = drill 0.813 long: A 5.08,0; C -5.08,0
DO41-7.6 = drill 1.1 pad 1.7 round: A 3.81,0; C -3.81,0
DIL8-SMD = smd 1.6 x 2: 1 -3.81,-4.77; 2 -1.27,-4.77; 3 1.27,-4.77; 4 3.81,-4.77; 5 3.81,4.77; 6 1.27,4.77; 7 -1.27,4.77; 8 -3.81,4.77
78XXS = drill 1.016 long: GND 0,-2.54; IN -2.54,-2.54; OUT 2.54,-2.54
DIL14 = drill 0.813 long: 1 -7.62,-3.81; 2 -5.08,-3.81; 3 -2.54,-3.81; 4 0,-3.81; 5 2.54,-3.81; 6 5.08,-3.81; 7 7.62,-3.81; 8 7.62,3.81; 9 5.08,3.81; 10 2.54,3.81; 11 0,3.81; 12 -2.54,3.81; 13 -5.08,3.81; 14 -7.62,3.81
DIL08 = drill 0.813 pad 1.27 round: 1 -3.81,-3.81; 2 -1.27,-3.81; 3 1.27,-3.81; 4 3.81,-3.81; 5 3.81,3.81; 6 1.27,3.81; 7 -1.27,3.81; 8 -3.81,3.81
G5LE = drill 1.321 long: 1 -7.493,-5.969; 2 -7.493,5.969; O 4.699,5.969; P -9.525,0; S 4.699,-5.969
SK104-PAD = drill 2.54 pad 3.81 round: K1 -12.7,-0.762; K2 12.7,-0.762
TO220V = drill 1.016 long: 1 -2.54,-2.54; 2 0,-2.54; 3 2.54,-2.54
TO92 = drill 0.813 octagon: 1 1.27,0; 2 0,1.905; 3 -1.27,0
TO220BV = drill 1.016 long: D 0,-2.54; G -2.54,-2.54; S 2.54,-2.54
TO220BH = drill 1.118 long: D 0,-6.35; G -2.54,-6.35; S 2.54,-6.35 | hole 3.302: 0,11.176
RTRIM3296W = drill 0.61 round: 1 0,-2.54; 2 0,0; 3 0,2.54
0204V = drill 0.813 octagon: 1 -1.27,0; 2 1.27,0
0414/15 = drill 1.016 octagon: 1 -7.62,0; 2 7.62,0
VTA54 = drill 1.1 octagon: 1 -12.065,0; 2 12.065,0
0207/10 = drill 0.813 octagon: 1 -5.08,0; 2 5.08,0
0204/5 = drill 0.813 octagon: 1 -2.54,0; 2 2.54,0
R1206 = smd 1.6 x 1.803: 1 -1.422,0; 2 1.422,0
0204/7 = drill 0.813 octagon: 1 -3.81,0; 2 3.81,0
R2010 = smd 1.8 x 2.7: 1 -2.2,0; 2 2.2,0
ML40 = drill 0.914 octagon: 1 -24.13,-1.27; 2 -24.13,1.27; 3 -21.59,-1.27; 4 -21.59,1.27; 5 -19.05,-1.27; 6 -19.05,1.27; 7 -16.51,-1.27; 8 -16.51,1.27; 9 -13.97,-1.27; 10 -13.97,1.27; 11 -11.43,-1.27; 12 -11.43,1.27; 13 -8.89,-1.27; 14 -8.89,1.27; 15 -6.35,-1.27; 16 -6.35,1.27; 17 -3.81,-1.27; 18 -3.81,1.27; 19 -1.27,-1.27; 20 -1.27,1.27; 21 1.27,-1.27; 22 1.27,1.27; 23 3.81,-1.27; 24 3.81,1.27; 25 6.35,-1.27; 26 6.35,1.27; 27 8.89,-1.27; 28 8.89,1.27; 29 11.43,-1.27; 30 11.43,1.27; 31 13.97,-1.27; 32 13.97,1.27; 33 16.51,-1.27; 34 16.51,1.27; 35 19.05,-1.27; 36 19.05,1.27; 37 21.59,-1.27; 38 21.59,1.27; 39 24.13,-1.27; 40 24.13,1.27
TMV_DUAL = drill 0.9 round: 1 -7.62,0; 2 -5.08,0; 5 2.54,0; 6 5.08,0; 7 7.62,0
AK500/3-H = drill 1.321 long: 1 -5.004,0; 2 0,0; 3 5.004,0
AK500/4-H = drill 1.321 long: 1 -7.518,0; 2 -2.489,0; 3 2.489,0; 4 7.518,0
SOD80C = smd 1.4 x 1.8: A 1.7,0; C -1.7,0

### Placement (x,y rotation side)
C201  66.04,117.47 180 top
C202  50.8,117.47 0 top
C203  2.54,122.56 90 top
C204  13.34,121.92 90 top
C205  13.34,129.54 270 top
C206  2.54,128.91 270 top
C207  58.42,117.47 180 top
C301  12.06,-76.83 0 top  (outside the outline)
C302  12.06,-103.5 0 top  (outside the outline)
C401  170.18,-54.61 90 top  (outside the outline)
C402  131.44,-53.98 90 top  (outside the outline)
C403  208.91,-54.61 90 top  (outside the outline)
C404  131.44,34.29 270 top  (outside the outline)
C501  3.17,95.25 0 top
C502  13.34,98.42 90 top
C505  35.56,74.93 0 top
C506  45.72,74.93 0 top
C507  146.05,34.29 90 top  (outside the outline)
C508  72.39,74.93 0 top
C509  84.45,101.6 270 top
C510  75.56,102.23 270 top
C511  75.56,94.61 90 top
C512  84.45,95.25 90 top
C601  102.23,168.91 180 top  (outside the outline)
C602  109.86,168.91 180 top  (outside the outline)
C603  66.04,133.99 270 bottom
C604  116.84,158.75 270 bottom  (outside the outline)
C605  116.2,154.94 0 bottom  (outside the outline)
C606  69.22,133.99 270 bottom
C701  33.02,180.97 270 top  (outside the outline)
D301  41.27,-121.28 0 top  (outside the outline)
D302  24.77,-138.43 0 top  (outside the outline)
D401  146.05,-40.01 90 top  (outside the outline)
D402  107.31,-39.37 90 top  (outside the outline)
D403  184.78,-40.01 90 top  (outside the outline)
D404  134.62,39.37 180 top  (outside the outline)
IC1  119.38,104.14 0 top  (outside the outline)
IC201  7.62,125.73 90 top
IC501  35.56,82.55 180 bottom
IC502  45.72,82.55 180 bottom
IC504  81.28,98.42 270 top
IC505  153.67,34.29 90 top  (outside the outline)
IC506  72.39,82.55 180 bottom
IC601  104.78,180.97 0 top  (outside the outline)
IC602  89.53,180.97 0 top  (outside the outline)
IC603  78.11,180.97 0 top  (outside the outline)
IC701  62.87,180.97 0 top  (outside the outline)
K301  11.43,-125.73 0 top  (outside the outline)
KK201  7.62,125.73 270 top
Q301  31.11,-118.75 0 top  (outside the outline)
Q302  8.26,-146.05 0 top  (outside the outline)
Q303  4.45,-172.09 0 top  (outside the outline)
Q401  157.48,-52.07 90 top  (outside the outline)
Q402  118.75,-51.44 90 top  (outside the outline)
Q403  196.22,-52.07 90 top  (outside the outline)
Q404  118.75,34.29 270 bottom  (outside the outline)
R1  95.89,170.81 0 top  (outside the outline)
R2  104.78,173.35 270 top  (outside the outline)
R3  112.39,173.35 90 top  (outside the outline)
R4  1.91,-182.25 0 top  (outside the outline)
R5  1.91,-189.23 0 top  (outside the outline)
R6  1.91,-195.58 0 top  (outside the outline)
R7  1.91,-201.93 0 top  (outside the outline)
R8  1.91,-208.28 0 top  (outside the outline)
R9  1.91,-214.63 0 top  (outside the outline)
R10  1.27,-219.07 0 top  (outside the outline)
R11  -15.88,-219.07 0 top  (outside the outline)
R12  -10.16,-219.07 0 top  (outside the outline)
R13  -21.59,-219.07 0 top  (outside the outline)
R14  -27.3,-219.07 0 top  (outside the outline)
R301  8.26,-139.7 0 top  (outside the outline)
R302  12.7,-155.57 0 top  (outside the outline)
R303  12.7,-165.74 0 top  (outside the outline)
R304  24.77,-146.05 0 top  (outside the outline)
R305  41.27,-138.43 0 top  (outside the outline)
R306  17.14,-173.35 0 top  (outside the outline)
R307  1.91,-146.05 0 top  (outside the outline)
R308  119.38,72.39 0 top  (outside the outline)
R401  170.18,-47.62 90 top  (outside the outline)
R402  131.44,-46.99 90 top  (outside the outline)
R403  177.16,-54.61 90 top  (outside the outline)
R404  138.43,-53.98 90 top  (outside the outline)
R405  170.18,-40.64 90 top  (outside the outline)
R406  131.44,-40.01 90 top  (outside the outline)
R407  208.91,-47.62 90 top  (outside the outline)
R408  139.06,34.29 270 top  (outside the outline)
R409  215.9,-54.61 90 top  (outside the outline)
R410  133.99,34.29 90 top  (outside the outline)
R411  208.91,-40.64 90 top  (outside the outline)
R412  143.51,34.29 270 top  (outside the outline)
R413  87.63,64.14 270 top
R414  234.95,-51.44 90 top  (outside the outline)
R415  85.09,64.14 90 top
R416  78.74,82.55 270 top
R601  109.86,173.35 90 top  (outside the outline)
R604  45.09,133.35 270 top
R605  99.69,173.35 90 top  (outside the outline)
R606  107.31,173.35 90 top  (outside the outline)
R608  102.23,173.35 270 top  (outside the outline)
R609  97.16,190.5 270 top  (outside the outline)
R610  99.69,190.5 270 top  (outside the outline)
R611  43.81,140.97 180 top
R612  102.23,190.5 90 top  (outside the outline)
R701  10.16,198.12 0 top  (outside the outline)
R702  53.34,200.03 0 top  (outside the outline)
R703  41.27,173.35 270 top  (outside the outline)
R705  48.9,173.35 270 top  (outside the outline)
RS401  90.17,53.34 180 bottom
RS402  101.6,-53.98 90 top  (outside the outline)
RS403  229.87,-53.98 90 top  (outside the outline)
RS404  223.52,-53.98 90 top  (outside the outline)
SV101  48.9,146.69 0 top
V201  57.15,114.94 0 top
V701  43.81,180.97 0 top  (outside the outline)
X101  29.21,7.62 0 top
X102  44.45,7.62 0 top
X103  62.23,7.62 0 top
ZD401  177.16,-47.62 90 top  (outside the outline)
ZD402  138.43,-46.99 90 top  (outside the outline)
ZD403  215.9,-47.62 90 top  (outside the outline)
ZD404  136.53,34.29 270 top  (outside the outline)

### Tracks (layer width: path | path; a pad name or v marks a point on that pad's centre or on a via)
+5V  (7 unrouted)
  Bottom 0.813: 55.24,182.25 IC701.14 | 55.24,182.25 60.33,182.25 | 36.2,182.25 33.02,182.25 C701.1 | 36.2,182.25 55.24,182.25 | 36.2,182.25 V701.14
+15V  (via drill 0.5 pad 1.42)  (5 unrouted)
  Top 0.813: 104.78,179.71 IC601.4 | 104.78,179.71 114.3,179.71 | 104.78,179.71 87,179.71 v85.72,179.71 77.47,179.71 74.3,182.88 IC603.8
  Bottom 0.813: v85.72,179.71 IC602.8
-15V  (via drill 0.5 pad 1.42)  (5 unrouted)
  Top 0.813: 104.78,182.25 IC601.11 | 104.78,182.25 114.3,182.25 | 104.78,182.25 v93.34,182.25 83.19,182.25 v81.92,182.25
  Bottom 0.813: v93.34,182.25 IC602.4 | IC603.4 v81.92,182.25
AGND  (14 unrouted)
ANALOG_IN_AC
  Bottom 0.813: 88.27,175.9 IC602.2 | 88.27,175.9 87.63,175.26 80.01,175.26 79.38,175.9 IC603.3 | R1.3 R1.2 | R1.3 90.81,173.35 88.27,175.9 | IC601.1 97.16,174.62 R1.3
BR  (1 unrouted)
CHARGE_RELAY  (1 unrouted)
DC+  (1 unrouted)
DC++  (7 unrouted)
DC--  (9 unrouted)
  Top 0.813: IC505.5 146.69,38.1 146.05,37.47 C507.2
DCB_CAP+  (5 unrouted)
DCB_CAP-  (11 unrouted)
G1  (3 unrouted)
G2  (2 unrouted)
  Top 0.813: 148.9,34.29 141.6,34.29 140.18,35.71 R408.1 139.06,38.73 D404.C
G3  (3 unrouted)
G4  (3 unrouted)
G_BR  (2 unrouted)
GATE_+15V  (5 unrouted)
  Top 0.813: IC505.8 146.69,30.48 146.05,31.11 C507.1
GND  (20 unrouted)
  Top 0.813: 33.66,189.87 31.11,187.32 31.11,180.34 C701.2
  Bottom 0.813: IC603.1 IC701.7 70.48,179.71 | 51.44,179.71 34.29,179.71 C701.2 | 51.44,179.71 60.33,179.71 | 60.33,179.71 62.87,179.71 | 62.87,179.71 65.41,179.71 | 65.41,179.71 67.94,179.71 | 67.94,179.71 70.48,179.71 | 67.94,179.71 IC701.6 | 65.41,179.71 IC701.5 | 62.87,179.71 IC701.4 | 60.33,179.71 IC701.3 | 51.44,179.71 V701.7 | 70.48,179.71 IC701.8
M+  (6 unrouted)
M-  (6 unrouted)
MCU_EN_G1  (2 unrouted)
MCU_EN_G2  (2 unrouted)
MCU_EN_G3  (2 unrouted)
MCU_EN_G4  (2 unrouted)
N$1  (1 unrouted)
N$2  (via drill 0.5 pad 6.45)
  other vias: 5,5
N$3  (via drill 0.5 pad 6.45)
  other vias: 90,5
N$4  (via drill 0.5 pad 6.45)
  other vias: 5,150
N$5  (via drill 0.5 pad 6.45)
  other vias: 90,150
N$6  (3 unrouted)
N$7  (1 unrouted)
N$8  (1 unrouted)
N$9  (1 unrouted)
N$10  (3 unrouted)
N$12  (1 unrouted)
N$13
  Bottom 1.016: 30.48,72.39 30.48,74.93
N$14  (1 unrouted)
N$15  (1 unrouted)
N$17  (1 unrouted)
N$18  (2 unrouted)
N$19  (1 unrouted)
N$22  (2 unrouted)
N$23  (2 unrouted)
N$24  (via drill 0.5 pad 3.81)
  other vias: 39.37,7.62
N$26  (via drill 0.5 pad 3.81)
  other vias: 54.61,7.62
N$27  (via drill 0.5 pad 3.81)
  other vias: 59.69,7.62
N$37  (1 unrouted)
N$38  (2 unrouted)
N$42  (2 unrouted)
N$59  (2 unrouted)
N$65  (via drill 0.5 pad 2.18)
  other vias: 50.16,145.41
N$66  (via drill 0.5 pad 2.18)
  other vias: 52.7,145.41
N$67  (via drill 0.5 pad 2.18)
  other vias: 55.24,145.41
N$68  (via drill 0.5 pad 2.18)
  other vias: 57.78,145.41
N$69  (via drill 0.5 pad 2.18)
  other vias: 60.33,145.41
N$70  (via drill 0.5 pad 2.18)
  other vias: 62.87,145.41
N$71  (via drill 0.5 pad 2.18)
  other vias: 65.41,145.41
N$72  (via drill 0.5 pad 2.18)
  other vias: 67.94,145.41
N$73  (via drill 0.5 pad 2.18)
  other vias: 70.48,145.41
N$74  (via drill 0.5 pad 2.18)
  other vias: 73.03,145.41
N$75  (via drill 0.5 pad 2.18)
  other vias: 73.03,147.96
N$76  (via drill 0.5 pad 2.18)
  other vias: 70.48,147.96
N$77  (via drill 0.5 pad 2.18)
  other vias: 67.94,147.96
N$78  (via drill 0.5 pad 2.18)
  other vias: 65.41,147.96
N$79  (via drill 0.5 pad 2.18)
  other vias: 62.87,147.96
N$80  (via drill 0.5 pad 2.18)
  other vias: 60.33,147.96
N$81  (via drill 0.5 pad 2.18)
  other vias: 57.78,147.96
N$82  (via drill 0.5 pad 2.18)
  other vias: 55.24,147.96
N$83  (via drill 0.5 pad 2.18)
  other vias: 52.7,147.96
N$84  (via drill 0.5 pad 2.18)
  other vias: 50.16,147.96
N$85
  Bottom 1.016: 40.64,72.39 40.64,74.93
N$91
  Bottom 1.016: 67.31,72.39 67.31,74.93
N$98
  Bottom 1.016: 77.47,72.39 77.47,74.93
N$100  (3 unrouted)
N$101
  Bottom 0.813: IC603.7 76.83,186.06 77.47,186.69 83.19,186.69 83.82,186.06 83.82,178.44 85.09,177.16 IC602.1
N$102  (1 unrouted)
  Bottom 0.813: IC601.14 R609.2
N$103
  Bottom 0.813: IC601.13 R610.2 R609.1
N$104
  Bottom 0.813: IC601.12 R612.1
N$107
  Bottom 0.813: R705.1 V701.6
N$108
  Bottom 0.813: R703.1 V701.3
N$109  (2 unrouted)
PE  (2 unrouted)
Q3_G
  Top 0.813: R408.2 139.06,33.66 138.43,34.29 137.16,34.29 136.53,34.92 ZD404.C 134.26,35.99 R410.2 133.96,35.69 C404.1 131.44,36.2 | D404.A 130.81,38.1 131.44,37.47 131.44,36.2 | Q404.G 130.81,36.83 131.44,36.2
Q3_G1  (5 unrouted)
Q3_G2  (5 unrouted)
Q3_G3  (5 unrouted)
RB_EXT  (3 unrouted)
RB_INT  (2 unrouted)
S1  (1 unrouted)
S2  (1 unrouted)
  Top 0.813: R412.1 143.53,35.69
S3  (1 unrouted)
S4  (1 unrouted)
S_BR  (1 unrouted)
SH1+  (1 unrouted)
SH1++  (5 unrouted)
  Top 0.813: R410.1 134.26,32.59 ZD404.A 136.53,31.75 137.79,30.48 142.88,30.48 143.51,31.11 R412.2
SH2+  (1 unrouted)
SH2++  (7 unrouted)
SP_CURRENT  (2 unrouted)
  Bottom 0.813: IC602.3 92.71,175.26 94.61,175.26 95.25,175.9 95.25,193.04 96.52,194.31 99.06,194.31 99.69,193.68 R610.1
TR_EN  (2 unrouted)
TR_EN_G1  (1 unrouted)
TR_EN_G2  (1 unrouted)
TR_EN_G3  (1 unrouted)
TR_EN_G4  (1 unrouted)
TR_EN_GATE  (2 unrouted)
  Top 0.61: 56.52,174.62 56.52,180.34
  Top 0.813: V701.4 43.81,179.07 43.18,179.71 37.47,179.71 36.2,178.44 V701.1 36.2,172.72 38.73,170.18 55.24,170.18 56.52,171.45 56.52,174.62 | IC701.13 57.78,181.61 56.52,180.34
TR_RESET  (2 unrouted)
  Bottom 0.813: IC602.7 88.27,187.32 87,188.59 67.31,188.59 65.41,186.69 IC701.10
TR_SET  (2 unrouted)

### Text on the board
tDocu: DC+ | DC- | PE | M+ | M- | PE | RB_INT | DC+ | RB_EXT | PE